# EAGLE schematic DM01 (EAGLE 6.6.0)

## Sheet 1 of 6
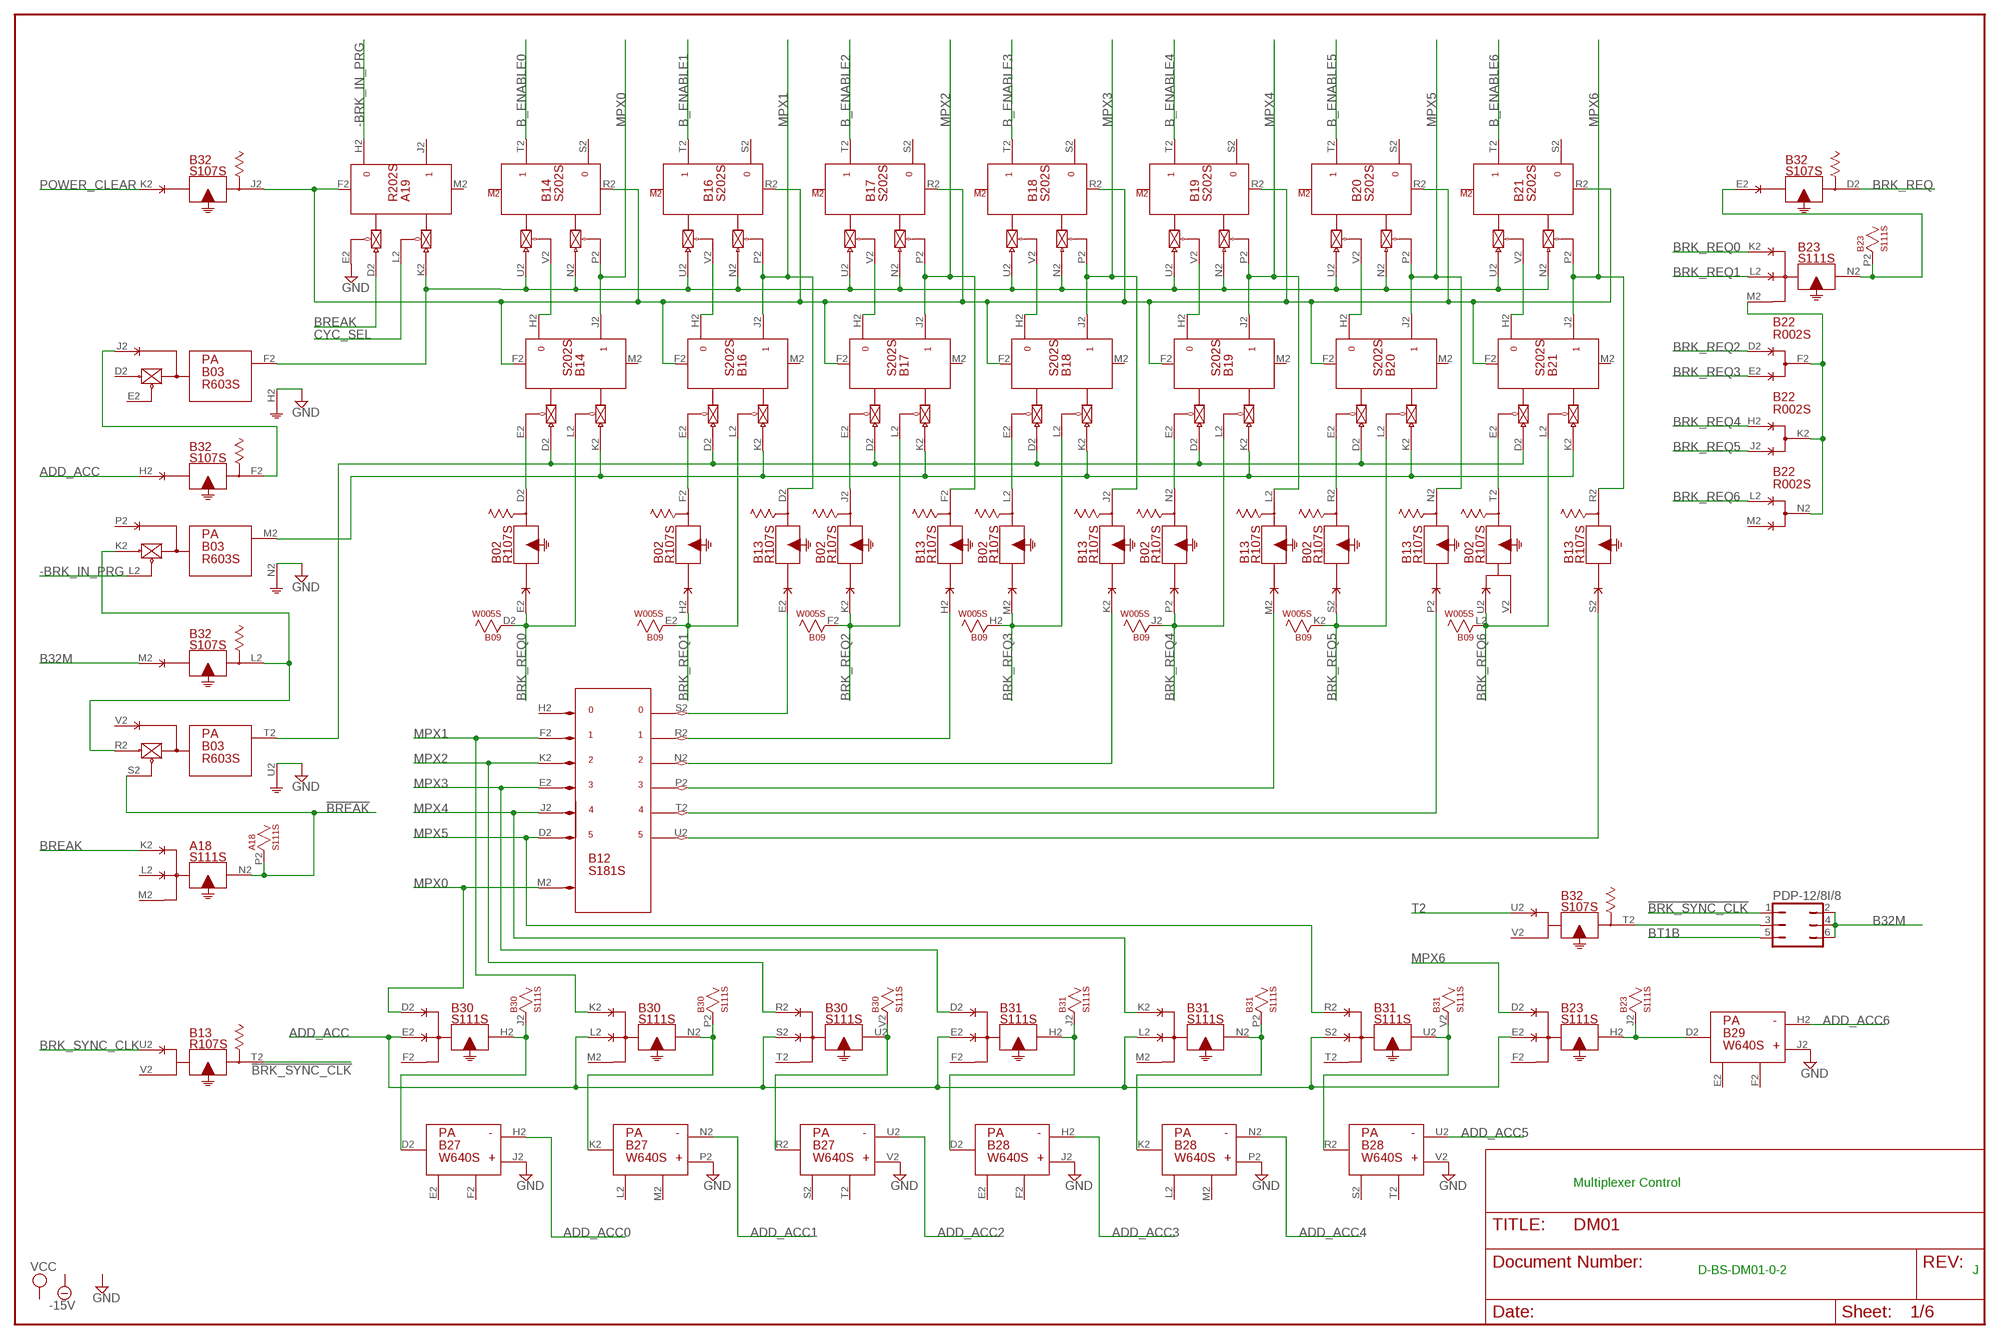
[diagram p0: schematic, sheet 1]

### Parts
A18  S111S  R111S  [H807S]
A19  R202S  [H807S]
B02  R107S  [H807S]
B03  R603S  [H807S]
B09  W005S  [H807S]
B12  S181S  R181S  [H807S]
B13  R107S  [H807S]
B14  S202S  R202S  [H807S]
B16  S202S  R202S  [H807S]
B17  S202S  R202S  [H807S]
B18  S202S  R202S  [H807S]
B19  S202S  R202S  [H807S]
B20  S202S  R202S  [H807S]
B21  S202S  R202S  [H807S]
B22  R002S  [H807S]
B23  S111S  R111S  [H807S]
B27  W640S  [H807S]
B28  W640S  [H807S]
B29  W640S  [H807S]
B30  S111S  R111S  [H807S]
B31  S111S  R111S  [H807S]
B32  S107S  R107S  [H807S]
PDP-12/8I/8  JP3Q  [JP3Q]

### Nets
!BREAK: A18.N2(N:O$1) A18.P2 B03.S2(T:EN0)
!BRK_SYNC_CLK: B13.T2(T:O$1) PDP-12/8I/8.1
-BRK_IN_PRG: A19.H2 B03.L2(M:EN0)
ADD_ACC: B23.E2(H:I$2) B30.E2(H:I$2) B30.L2(N:I$2) B30.S2(U:I$2) B31.E2(H:I$2) B31.L2(N:I$2) B31.S2(U:I$2) B32.H2(F:I$1) ; also sheet 2
ADD_ACC0: B27.H2(H) ; also sheet 2
ADD_ACC1: B27.N2(H) ; also sheet 2
ADD_ACC2: B27.U2(H) ; also sheet 2
ADD_ACC3: B28.H2(H) ; also sheet 2
ADD_ACC4: B28.N2(H) ; also sheet 2
ADD_ACC5: B28.U2(H) ; also sheet 2
ADD_ACC6: B29.H2(H) ; also sheet 2
B32M: B32.M2(L:I$1) PDP-12/8I/8.2 PDP-12/8I/8.4 PDP-12/8I/8.6
B_ENABLE0: B14.T2 ; also sheet 2,4
B_ENABLE1: B16.T2 ; also sheet 2,4
B_ENABLE2: B17.T2 ; also sheet 2,4
B_ENABLE3: B18.T2 ; also sheet 2,4
B_ENABLE4: B19.T2 ; also sheet 2,4
B_ENABLE5: B20.T2 ; also sheet 2,4
B_ENABLE6: B21.T2 ; also sheet 2,4
BREAK: A18.K2(N:I$1) A19.D2(J:PU0) ; also sheet 2,4
BRK_REQ: B32.D2(D:O$1) ; also sheet 2
BRK_REQ0: B02.E2(D:I$1) B09.D2 B14.L2(J:EN1) B23.K2(N:I$1) ; also sheet 2
BRK_REQ1: B02.H2(F:I$1) B09.E2 B16.L2(J:EN1) B23.L2(N:I$2) ; also sheet 2
BRK_REQ2: B02.K2(J:I$1) B09.F2 B17.L2(J:EN1) B22.D2(F:D) ; also sheet 2
BRK_REQ3: B02.M2(L:I$1) B09.H2 B18.L2(J:EN1) B22.E2(F:E) ; also sheet 2
BRK_REQ4: B02.P2(N:I$1) B09.J2 B19.L2(J:EN1) B22.H2(K:D) ; also sheet 2
BRK_REQ5: B02.S2(R:I$1) B09.K2 B20.L2(J:EN1) B22.J2(K:E) ; also sheet 2
BRK_REQ6: B02.U2(T:I$1) B09.L2 B21.L2(J:EN1) B22.L2(N:D) ; also sheet 2
BRK_SYNC_CLK: B13.U2(T:I$1) ; also sheet 3
BT1B: PDP-12/8I/8.5 ; also sheet 3
CYC_SEL: A19.L2(J:EN1) ; also sheet 2,5
GND [Supply]: A19.E2(J:EN0) B03.H2(F:G) B03.N2(M:G) B03.U2(T:G) B27.J2(J) B27.P2(J) B27.V2(J) B28.J2(J) B28.P2(J) B28.V2(J) B29.J2(J) ; also sheet 4
MPX0: B12.M2(M) B14.J2 B14.P2(T:EN0) B30.D2(H:I$1) ; also sheet 2,4
MPX1: B12.F2(F) B13.D2(D:O$1) B16.J2 B16.P2(T:EN0) B30.K2(N:I$1) ; also sheet 2,4
MPX2: B12.K2(K) B13.F2(F:O$1) B17.J2 B17.P2(T:EN0) B30.R2(U:I$1) ; also sheet 2,4
MPX3: B12.E2(E) B13.J2(J:O$1) B18.J2 B18.P2(T:EN0) B31.D2(H:I$1) ; also sheet 2,4
MPX4: B12.J2(J) B13.L2(L:O$1) B19.J2 B19.P2(T:EN0) B31.K2(N:I$1) ; also sheet 2,4
MPX5: B12.D2(D) B13.N2(N:O$1) B20.J2 B20.P2(T:EN0) B31.R2(U:I$1) ; also sheet 2,4
MPX6: B13.R2(R:O$1) B21.J2 B21.P2(T:EN0) B23.D2(H:I$1) ; also sheet 2,4
N$1: A19.K2(J:PU1) B03.F2(F:O) B14.N2(T:PU0) B14.U2(T:PU1) B16.N2(T:PU0) B16.U2(T:PU1) B17.N2(T:PU0) B17.U2(T:PU1) B18.N2(T:PU0) B18.U2(T:PU1) B19.N2(T:PU0) B19.U2(T:PU1) B20.N2(T:PU0) B20.U2(T:PU1) B21.N2(T:PU0) B21.U2(T:PU1)
N$2: A19.F2(J:RESET) B14.F2(J:RESET) B14.R2(T:RESET) B16.F2(J:RESET) B16.R2(T:RESET) B17.F2(J:RESET) B17.R2(T:RESET) B18.F2(J:RESET) B18.R2(T:RESET) B19.F2(J:RESET) B19.R2(T:RESET) B20.F2(J:RESET) B20.R2(T:RESET) B21.F2(J:RESET) B21.R2(T:RESET) B32.J2(J:O$1)
N$3: B03.J2(F:I$1) B32.F2(F:O$1)
N$4: B32.T2(T:O$1) PDP-12/8I/8.3
N$5: B03.K2(M:PU0) B03.R2(T:PU0) B32.L2(L:O$1)
N$6: B03.M2(M:O) B14.K2(J:PU1) B16.K2(J:PU1) B17.K2(J:PU1) B18.K2(J:PU1) B19.K2(J:PU1) B20.K2(J:PU1) B21.K2(J:PU1)
N$7: B14.H2 B14.V2(T:EN1)
N$9: B16.H2 B16.V2(T:EN1)
N$11: B17.H2 B17.V2(T:EN1)
N$13: B18.H2 B18.V2(T:EN1)
N$15: B19.H2 B19.V2(T:EN1)
N$17: B20.H2 B20.V2(T:EN1)
N$19: B21.H2 B21.V2(T:EN1)
N$21: B23.N2(N:O$1) B23.P2 B32.E2(D:I$1)
N$22: B22.F2(F:F) B22.K2(K:F) B22.N2(N:F) B23.M2(N:I$3)
N$23: B02.D2(D:O$1) B14.E2(J:EN0)
N$24: B02.F2(F:O$1) B16.E2(J:EN0)
N$25: B02.J2(J:O$1) B17.E2(J:EN0)
N$26: B02.L2(L:O$1) B18.E2(J:EN0)
N$27: B02.N2(N:O$1) B19.E2(J:EN0)
N$28: B02.R2(R:O$1) B20.E2(J:EN0)
N$29: B02.T2(T:O$1) B21.E2(J:EN0)
N$30: B27.D2(D) B30.H2(H:O$1) B30.J2
N$32: B03.T2(T:O) B14.D2(J:PU0) B16.D2(J:PU0) B17.D2(J:PU0) B18.D2(J:PU0) B19.D2(J:PU0) B20.D2(J:PU0) B21.D2(J:PU0)
N$36: B27.K2(D) B30.N2(N:O$1) B30.P2
N$37: B27.R2(D) B30.U2(U:O$1) B30.V2
N$38: B12.S2(S) B13.E2(D:I$1)
N$39: B12.R2(R) B13.H2(F:I$1)
N$40: B12.N2(N) B13.K2(J:I$1)
N$41: B12.P2(P) B13.M2(L:I$1)
N$42: B12.T2(T) B13.P2(N:I$1)
N$43: B12.U2(U) B13.S2(R:I$1)
N$45: B28.D2(D) B31.H2(H:O$1) B31.J2
N$46: B28.K2(D) B31.N2(N:O$1) B31.P2
N$47: B28.R2(D) B31.U2(U:O$1) B31.V2
N$48: B23.H2(H:O$1) B23.J2 B29.D2(D)
POWER_CLEAR: B32.K2(J:I$1) ; also sheet 3
T2: B32.U2(T:I$1) ; also sheet 3
Unconnected: A18.L2(N:I$2) A18.M2(N:I$3) A18.R2(U:I$1) A18.S2(U:I$2) A18.T2(U:I$3) A18.U2(U:O$1) A18.V2 A19.J2 A19.M2(J:SET) A19.N2(T:PU0) A19.P2(T:EN0) A19.R2(T:RESET) A19.S2 A19.T2 A19.U2(T:PU1) A19.V2(T:EN1) B02.V2(T:I$2) B03.D2(F:PU0) B03.E2(F:EN0) B03.P2(M:I$1) B03.V2(T:I$1) B09.U2 B12.H2(H) B12.L2(I$1) B12.V2(O$1) B13.V2(T:I$2) B14.M2(J:SET) B14.S2 B16.M2(J:SET) B16.S2 B17.M2(J:SET) B17.S2 B18.M2(J:SET) B18.S2 B19.M2(J:SET) B19.S2 B20.M2(J:SET) B20.S2 B21.M2(J:SET) B21.S2 B22.M2(N:E) B22.P2(S:D) B22.R2(S:E) B22.S2(S:F) B22.T2(V:D) B22.U2(V:E) B22.V2(V:F) B23.F2(H:I$3) B27.E2(E) B27.F2(F) B27.L2(E) B27.M2(F) B27.S2(E) B27.T2(F) B28.E2(E) B28.F2(F) B28.L2(E) B28.M2(F) B28.S2(E) B28.T2(F) B29.E2(E) B29.F2(F) B30.F2(H:I$3) B30.M2(N:I$3) B30.T2(U:I$3) B31.F2(H:I$3) B31.M2(N:I$3) B31.T2(U:I$3) B32.V2(T:I$2)

### Notes on the sheet
- Multiplexer Control
- D-BS-DM01-0-2 | J

## Sheet 2 of 6
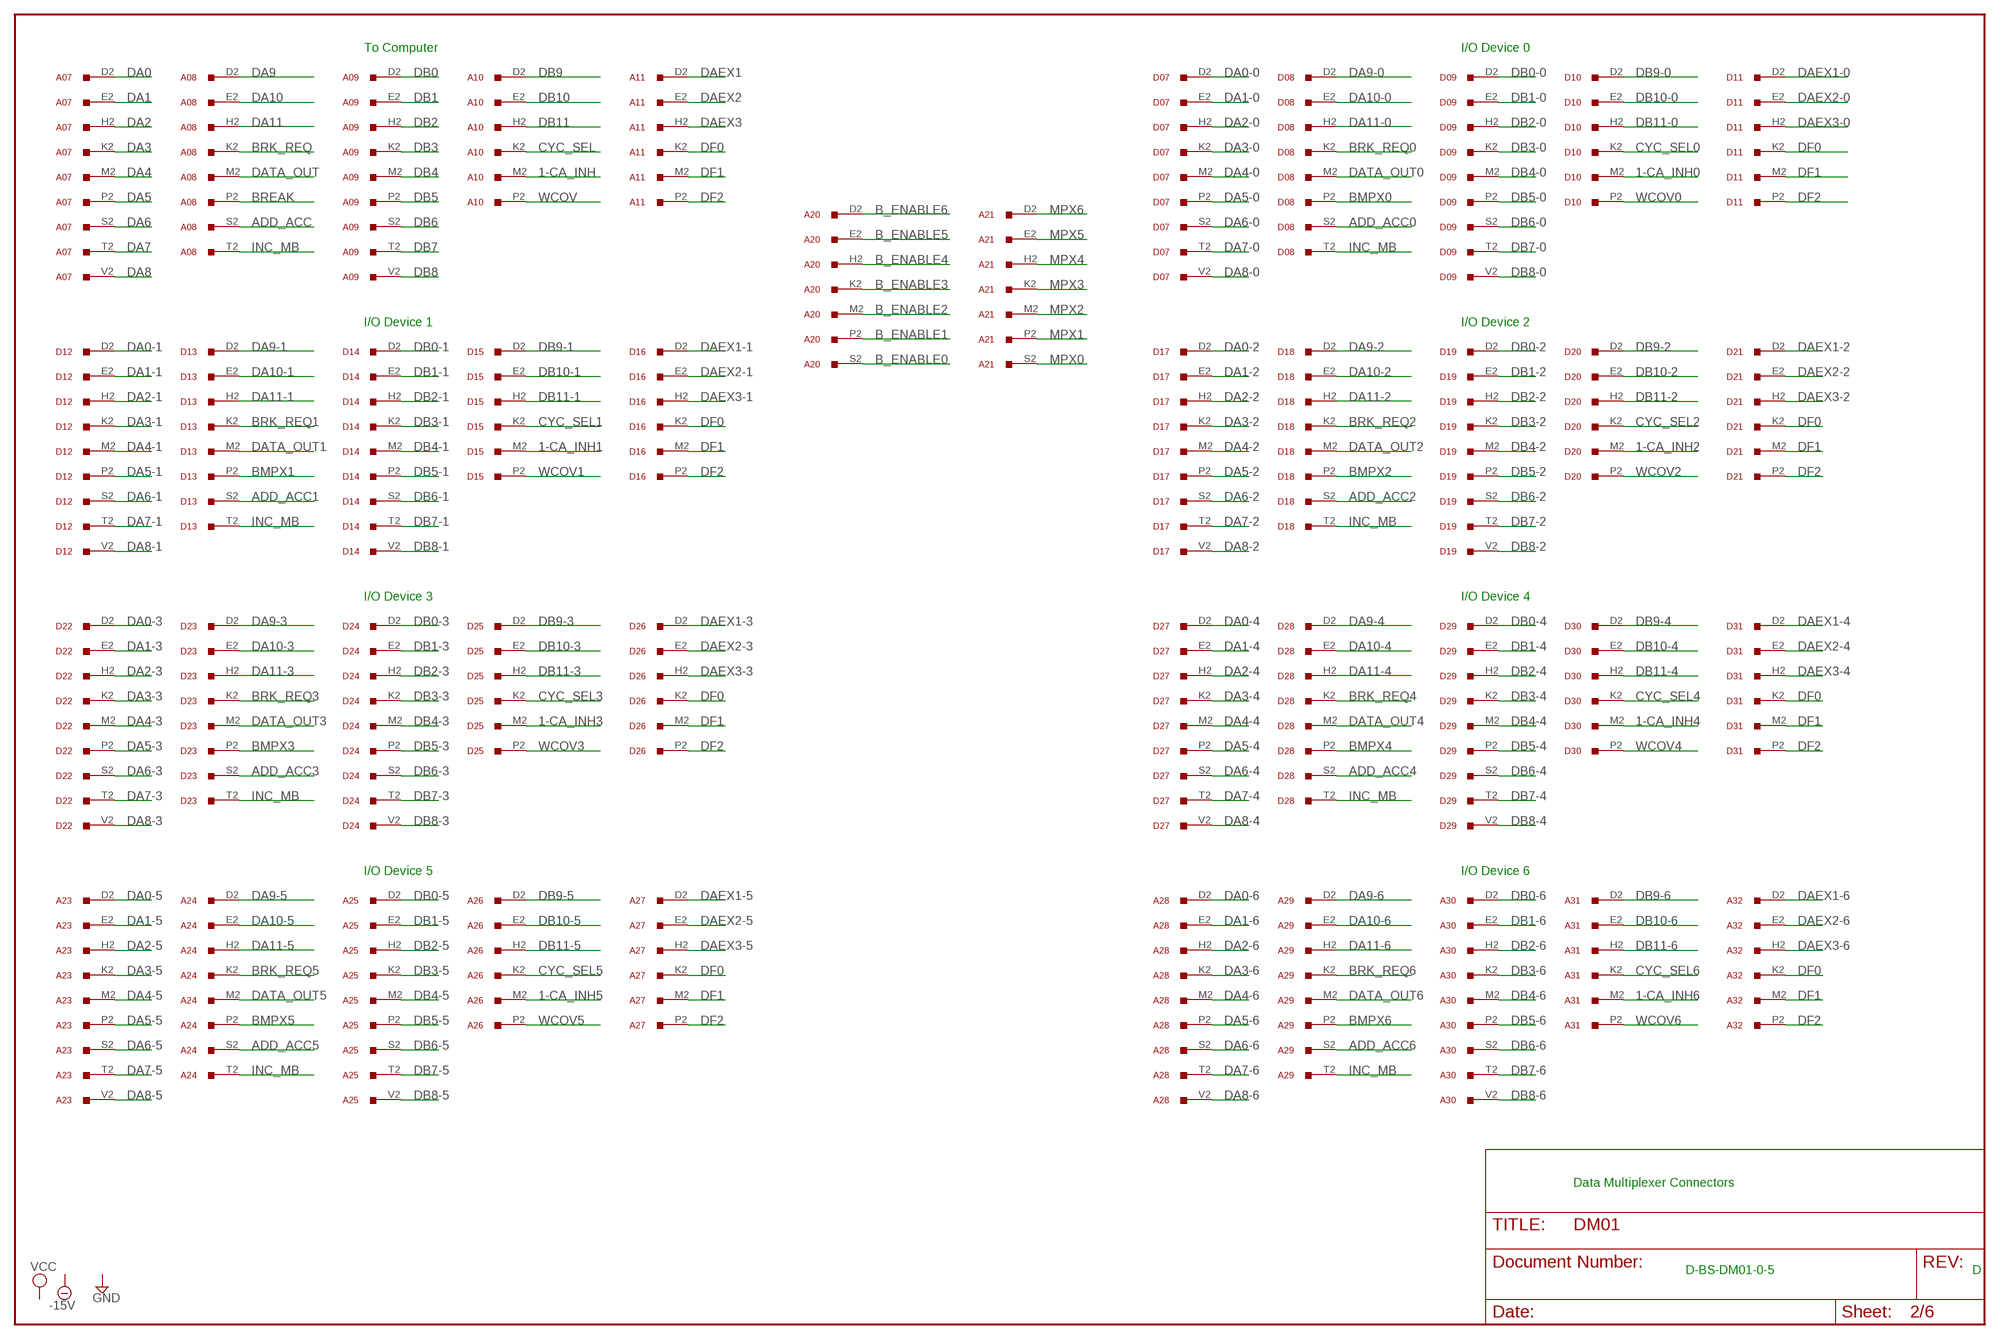
[diagram p1: schematic, sheet 2]

### Parts
A07  W021S  [H807S]
A08  W021S  [H807S]
A09  W021S  [H807S]
A10  W021S  [H807S]
A11  W021S  [H807S]
A20  W021S  [H807S]
A21  W021S  [H807S]
A23  W021S  [H807S]
A24  W021S  [H807S]
A25  W021S  [H807S]
A26  W021S  [H807S]
A27  W021S  [H807S]
A28  W021S  [H807S]
A29  W021S  [H807S]
A30  W021S  [H807S]
A31  W021S  [H807S]
A32  W021S  [H807S]
D07  W021S  [H807S]
D08  W021S  [H807S]
D09  W021S  [H807S]
D10  W021S  [H807S]
D11  W021S  [H807S]
D12  W021S  [H807S]
D13  W021S  [H807S]
D14  W021S  [H807S]
D15  W021S  [H807S]
D16  W021S  [H807S]
D17  W021S  [H807S]
D18  W021S  [H807S]
D19  W021S  [H807S]
D20  W021S  [H807S]
D21  W021S  [H807S]
D22  W021S  [H807S]
D23  W021S  [H807S]
D24  W021S  [H807S]
D25  W021S  [H807S]
D26  W021S  [H807S]
D27  W021S  [H807S]
D28  W021S  [H807S]
D29  W021S  [H807S]
D30  W021S  [H807S]
D31  W021S  [H807S]

### Nets
1-CA_INH: A10.M2 ; also sheet 6
1-CA_INH0: D10.M2 ; also sheet 6
1-CA_INH1: D15.M2 ; also sheet 6
1-CA_INH2: D20.M2 ; also sheet 6
1-CA_INH3: D25.M2 ; also sheet 6
1-CA_INH4: D30.M2 ; also sheet 6
1-CA_INH5: A26.M2 ; also sheet 6
1-CA_INH6: A31.M2 ; also sheet 6
ADD_ACC: A08.S2 ; also sheet 1
ADD_ACC0: D08.S2 ; also sheet 1
ADD_ACC1: D13.S2 ; also sheet 1
ADD_ACC2: D18.S2 ; also sheet 1
ADD_ACC3: D23.S2 ; also sheet 1
ADD_ACC4: D28.S2 ; also sheet 1
ADD_ACC5: A24.S2 ; also sheet 1
ADD_ACC6: A29.S2 ; also sheet 1
B_ENABLE0: A20.S2 ; also sheet 1,4
B_ENABLE1: A20.P2 ; also sheet 1,4
B_ENABLE2: A20.M2 ; also sheet 1,4
B_ENABLE3: A20.K2 ; also sheet 1,4
B_ENABLE4: A20.H2 ; also sheet 1,4
B_ENABLE5: A20.E2 ; also sheet 1,4
B_ENABLE6: A20.D2 ; also sheet 1,4
BMPX0: D08.P2 ; also sheet 4
BMPX1: D13.P2 ; also sheet 4
BMPX2: D18.P2 ; also sheet 4
BMPX3: D23.P2 ; also sheet 4
BMPX4: D28.P2 ; also sheet 4
BMPX5: A24.P2 ; also sheet 4
BMPX6: A29.P2 ; also sheet 4
BREAK: A08.P2 ; also sheet 1,4
BRK_REQ: A08.K2 ; also sheet 1
BRK_REQ0: D08.K2 ; also sheet 1
BRK_REQ1: D13.K2 ; also sheet 1
BRK_REQ2: D18.K2 ; also sheet 1
BRK_REQ3: D23.K2 ; also sheet 1
BRK_REQ4: D28.K2 ; also sheet 1
BRK_REQ5: A24.K2 ; also sheet 1
BRK_REQ6: A29.K2 ; also sheet 1
CYC_SEL: A10.K2 ; also sheet 1,5
CYC_SEL0: D10.K2 ; also sheet 5
CYC_SEL1: D15.K2 ; also sheet 5
CYC_SEL2: D20.K2 ; also sheet 5
CYC_SEL3: D25.K2 ; also sheet 5
CYC_SEL4: D30.K2 ; also sheet 5
CYC_SEL5: A26.K2 ; also sheet 5
CYC_SEL6: A31.K2 ; also sheet 5
DA0: A07.D2 ; also sheet 5
DA0-0: D07.D2 ; also sheet 5
DA0-1: D12.D2 ; also sheet 5
DA0-2: D17.D2 ; also sheet 5
DA0-3: D22.D2 ; also sheet 5
DA0-4: D27.D2 ; also sheet 5
DA0-5: A23.D2 ; also sheet 5
DA0-6: A28.D2 ; also sheet 5
DA1: A07.E2 ; also sheet 5
DA1-0: D07.E2 ; also sheet 5
DA1-1: D12.E2 ; also sheet 5
DA1-2: D17.E2 ; also sheet 5
DA1-3: D22.E2 ; also sheet 5
DA1-4: D27.E2 ; also sheet 5
DA1-5: A23.E2 ; also sheet 5
DA1-6: A28.E2 ; also sheet 5
DA2: A07.H2 ; also sheet 5
DA2-0: D07.H2 ; also sheet 5
DA2-1: D12.H2 ; also sheet 5
DA2-2: D17.H2 ; also sheet 5
DA2-3: D22.H2 ; also sheet 5
DA2-4: D27.H2 ; also sheet 5
DA2-5: A23.H2 ; also sheet 5
DA2-6: A28.H2 ; also sheet 5
DA3: A07.K2 ; also sheet 5
DA3-0: D07.K2 ; also sheet 5
DA3-1: D12.K2 ; also sheet 5
DA3-2: D17.K2 ; also sheet 5
DA3-3: D22.K2 ; also sheet 5
DA3-4: D27.K2 ; also sheet 5
DA3-5: A23.K2 ; also sheet 5
DA3-6: A28.K2 ; also sheet 5
DA4: A07.M2 ; also sheet 5
DA4-0: D07.M2 ; also sheet 5
DA4-1: D12.M2 ; also sheet 5
DA4-2: D17.M2 ; also sheet 5
DA4-3: D22.M2 ; also sheet 5
DA4-4: D27.M2 ; also sheet 5
DA4-5: A23.M2 ; also sheet 5
DA4-6: A28.M2 ; also sheet 5
DA5: A07.P2 ; also sheet 5
DA5-0: D07.P2 ; also sheet 5
DA5-1: D12.P2 ; also sheet 5
DA5-2: D17.P2 ; also sheet 5
DA5-3: D22.P2 ; also sheet 5
DA5-4: D27.P2 ; also sheet 5
DA5-5: A23.P2 ; also sheet 5
DA5-6: A28.P2 ; also sheet 5
DA6: A07.S2 ; also sheet 5
DA6-0: D07.S2 ; also sheet 5
DA6-1: D12.S2 ; also sheet 5
DA6-2: D17.S2 ; also sheet 5
DA6-3: D22.S2 ; also sheet 5
DA6-4: D27.S2 ; also sheet 5
DA6-5: A23.S2 ; also sheet 5
DA6-6: A28.S2 ; also sheet 5
DA7: A07.T2 ; also sheet 5
DA7-0: D07.T2 ; also sheet 5
DA7-1: D12.T2 ; also sheet 5
DA7-2: D17.T2 ; also sheet 5
DA7-3: D22.T2 ; also sheet 5
DA7-4: D27.T2 ; also sheet 5
DA7-5: A23.T2 ; also sheet 5
DA7-6: A28.T2 ; also sheet 5
DA8: A07.V2 ; also sheet 5
DA8-0: D07.V2 ; also sheet 5
DA8-1: D12.V2 ; also sheet 5
DA8-2: D17.V2 ; also sheet 5
DA8-3: D22.V2 ; also sheet 5
DA8-4: D27.V2 ; also sheet 5
DA8-5: A23.V2 ; also sheet 5
DA8-6: A28.V2 ; also sheet 5
DA9: A08.D2 ; also sheet 5
DA9-0: D08.D2 ; also sheet 5
DA9-1: D13.D2 ; also sheet 5
DA9-2: D18.D2 ; also sheet 5
DA9-3: D23.D2 ; also sheet 5
DA9-4: D28.D2 ; also sheet 5
DA9-5: A24.D2 ; also sheet 5
DA9-6: A29.D2 ; also sheet 5
DA10: A08.E2 ; also sheet 5
DA10-0: D08.E2 ; also sheet 5
DA10-1: D13.E2 ; also sheet 5
DA10-2: D18.E2 ; also sheet 5
DA10-3: D23.E2 ; also sheet 5
DA10-4: D28.E2 ; also sheet 5
DA10-5: A24.E2 ; also sheet 5
DA10-6: A29.E2 ; also sheet 5
DA11: A08.H2 ; also sheet 5
DA11-0: D08.H2 ; also sheet 5
DA11-1: D13.H2 ; also sheet 5
DA11-2: D18.H2 ; also sheet 5
DA11-3: D23.H2 ; also sheet 5
DA11-4: D28.H2 ; also sheet 5
DA11-5: A24.H2 ; also sheet 5
DA11-6: A29.H2 ; also sheet 5
DAEX1: A11.D2 ; also sheet 5
DAEX1-0: D11.D2 ; also sheet 5
DAEX1-1: D16.D2 ; also sheet 5
DAEX1-2: D21.D2 ; also sheet 5
DAEX1-3: D26.D2 ; also sheet 5
DAEX1-4: D31.D2 ; also sheet 5
DAEX1-5: A27.D2 ; also sheet 5
DAEX1-6: A32.D2 ; also sheet 5
DAEX2: A11.E2 ; also sheet 5
DAEX2-0: D11.E2 ; also sheet 5
DAEX2-1: D16.E2 ; also sheet 5
DAEX2-2: D21.E2 ; also sheet 5
DAEX2-3: D26.E2 ; also sheet 5
DAEX2-4: D31.E2 ; also sheet 5
DAEX2-5: A27.E2 ; also sheet 5
DAEX2-6: A32.E2 ; also sheet 5
DAEX3: A11.H2 ; also sheet 5
DAEX3-0: D11.H2 ; also sheet 5
DAEX3-1: D16.H2 ; also sheet 5
DAEX3-2: D21.H2 ; also sheet 5
DAEX3-3: D26.H2 ; also sheet 5
DAEX3-4: D31.H2 ; also sheet 5
DAEX3-5: A27.H2 ; also sheet 5
DAEX3-6: A32.H2 ; also sheet 5
DATA_OUT: A08.M2 ; also sheet 6
DATA_OUT0: D08.M2 ; also sheet 6
DATA_OUT1: D13.M2 ; also sheet 6
DATA_OUT2: D18.M2 ; also sheet 6
DATA_OUT3: D23.M2 ; also sheet 6
DATA_OUT4: D28.M2 ; also sheet 6
DATA_OUT5: A24.M2 ; also sheet 6
DATA_OUT6: A29.M2 ; also sheet 6
DB0: A09.D2 ; also sheet 6
DB0-0: D09.D2 ; also sheet 6
DB0-1: D14.D2 ; also sheet 6
DB0-2: D19.D2 ; also sheet 6
DB0-3: D24.D2 ; also sheet 6
DB0-4: D29.D2 ; also sheet 6
DB0-5: A25.D2 ; also sheet 6
DB0-6: A30.D2 ; also sheet 6
DB1: A09.E2 ; also sheet 6
DB1-0: D09.E2 ; also sheet 6
DB1-1: D14.E2 ; also sheet 6
DB1-2: D19.E2 ; also sheet 6
DB1-3: D24.E2 ; also sheet 6
DB1-4: D29.E2 ; also sheet 6
DB1-5: A25.E2 ; also sheet 6
DB1-6: A30.E2 ; also sheet 6
DB2: A09.H2 ; also sheet 6
DB2-0: D09.H2 ; also sheet 6
DB2-1: D14.H2 ; also sheet 6
DB2-2: D19.H2 ; also sheet 6
DB2-3: D24.H2 ; also sheet 6
DB2-4: D29.H2 ; also sheet 6
DB2-5: A25.H2 ; also sheet 6
DB2-6: A30.H2 ; also sheet 6
DB3: A09.K2 ; also sheet 6
DB3-0: D09.K2 ; also sheet 6
DB3-1: D14.K2 ; also sheet 6
DB3-2: D19.K2 ; also sheet 6
DB3-3: D24.K2 ; also sheet 6
DB3-4: D29.K2 ; also sheet 6
DB3-5: A25.K2 ; also sheet 6
DB3-6: A30.K2 ; also sheet 6
DB4: A09.M2 ; also sheet 6
DB4-0: D09.M2 ; also sheet 6
DB4-1: D14.M2 ; also sheet 6
DB4-2: D19.M2 ; also sheet 6
DB4-3: D24.M2 ; also sheet 6
DB4-4: D29.M2 ; also sheet 6
DB4-5: A25.M2 ; also sheet 6
DB4-6: A30.M2 ; also sheet 6
DB5: A09.P2 ; also sheet 6
DB5-0: D09.P2 ; also sheet 6
DB5-1: D14.P2 ; also sheet 6
DB5-2: D19.P2 ; also sheet 6
DB5-3: D24.P2 ; also sheet 6
DB5-4: D29.P2 ; also sheet 6
DB5-5: A25.P2 ; also sheet 6
DB5-6: A30.P2 ; also sheet 6
DB6: A09.S2 ; also sheet 6
DB6-0: D09.S2 ; also sheet 6
DB6-1: D14.S2 ; also sheet 6
DB6-2: D19.S2 ; also sheet 6
DB6-3: D24.S2 ; also sheet 6
DB6-4: D29.S2 ; also sheet 6
DB6-5: A25.S2 ; also sheet 6
DB6-6: A30.S2 ; also sheet 6
DB7: A09.T2 ; also sheet 6
DB7-0: D09.T2 ; also sheet 6
DB7-1: D14.T2 ; also sheet 6
DB7-2: D19.T2 ; also sheet 6
DB7-3: D24.T2 ; also sheet 6
DB7-4: D29.T2 ; also sheet 6
DB7-5: A25.T2 ; also sheet 6
DB7-6: A30.T2 ; also sheet 6
DB8: A09.V2 ; also sheet 6
DB8-0: D09.V2 ; also sheet 6
DB8-1: D14.V2 ; also sheet 6
DB8-2: D19.V2 ; also sheet 6
DB8-3: D24.V2 ; also sheet 6
DB8-4: D29.V2 ; also sheet 6
DB8-5: A25.V2 ; also sheet 6
DB8-6: A30.V2 ; also sheet 6
DB9: A10.D2 ; also sheet 6
DB9-0: D10.D2 ; also sheet 6
DB9-1: D15.D2 ; also sheet 6
DB9-2: D20.D2 ; also sheet 6
DB9-3: D25.D2 ; also sheet 6
DB9-4: D30.D2 ; also sheet 6
DB9-5: A26.D2 ; also sheet 6
DB9-6: A31.D2 ; also sheet 6
DB10: A10.E2 ; also sheet 6
DB10-0: D10.E2 ; also sheet 6
DB10-1: D15.E2 ; also sheet 6
DB10-2: D20.E2 ; also sheet 6
DB10-3: D25.E2 ; also sheet 6
DB10-4: D30.E2 ; also sheet 6
DB10-5: A26.E2 ; also sheet 6
DB10-6: A31.E2 ; also sheet 6
DB11: A10.H2 ; also sheet 6
DB11-0: D10.H2 ; also sheet 6
DB11-1: D15.H2 ; also sheet 6
DB11-2: D20.H2 ; also sheet 6
DB11-3: D25.H2 ; also sheet 6
DB11-4: D30.H2 ; also sheet 6
DB11-5: A26.H2 ; also sheet 6
DB11-6: A31.H2 ; also sheet 6
DF0: A11.K2 A27.K2 A32.K2 D11.K2 D16.K2 D21.K2 D26.K2 D31.K2
DF1: A11.M2 A27.M2 A32.M2 D11.M2 D16.M2 D21.M2 D26.M2 D31.M2
DF2: A11.P2 A27.P2 A32.P2 D11.P2 D16.P2 D21.P2 D26.P2 D31.P2
INC_MB: A08.T2 A24.T2 A29.T2 D08.T2 D13.T2 D18.T2 D23.T2 D28.T2
MPX0: A21.S2 ; also sheet 1,4
MPX1: A21.P2 ; also sheet 1,4
MPX2: A21.M2 ; also sheet 1,4
MPX3: A21.K2 ; also sheet 1,4
MPX4: A21.H2 ; also sheet 1,4
MPX5: A21.E2 ; also sheet 1,4
MPX6: A21.D2 ; also sheet 1,4
WCOV: A10.P2 ; also sheet 4
WCOV0: D10.P2 ; also sheet 4
WCOV1: D15.P2 ; also sheet 4
WCOV2: D20.P2 ; also sheet 4
WCOV3: D25.P2 ; also sheet 4
WCOV4: D30.P2 ; also sheet 4
WCOV5: A26.P2 ; also sheet 4
WCOV6: A31.P2 ; also sheet 4
Unconnected: A08.V2 A10.S2 A10.T2 A10.V2 A11.S2 A11.T2 A11.V2 A20.T2 A20.V2 A21.T2 A21.V2 A24.V2 A26.S2 A26.T2 A26.V2 A27.S2 A27.T2 A27.V2 A29.V2 A31.S2 A31.T2 A31.V2 A32.S2 A32.T2 A32.V2 D08.V2 D10.S2 D10.T2 D10.V2 D11.S2 D11.T2 D11.V2 D13.V2 D15.S2 D15.T2 D15.V2 D16.S2 D16.T2 D16.V2 D18.V2 D20.S2 D20.T2 D20.V2 D21.S2 D21.T2 D21.V2 D23.V2 D25.S2 D25.T2 D25.V2 D26.S2 D26.T2 D26.V2 D28.V2 D30.S2 D30.T2 D30.V2 D31.S2 D31.T2 D31.V2

### Notes on the sheet
- To Computer | I/O Device 0
- I/O Device 1 | I/O Device 2
- I/O Device 3 | I/O Device 4
- I/O Device 5 | I/O Device 6
- Data Multiplexer Connectors
- D-BS-DM01-0-5 | D

## Sheet 3 of 6
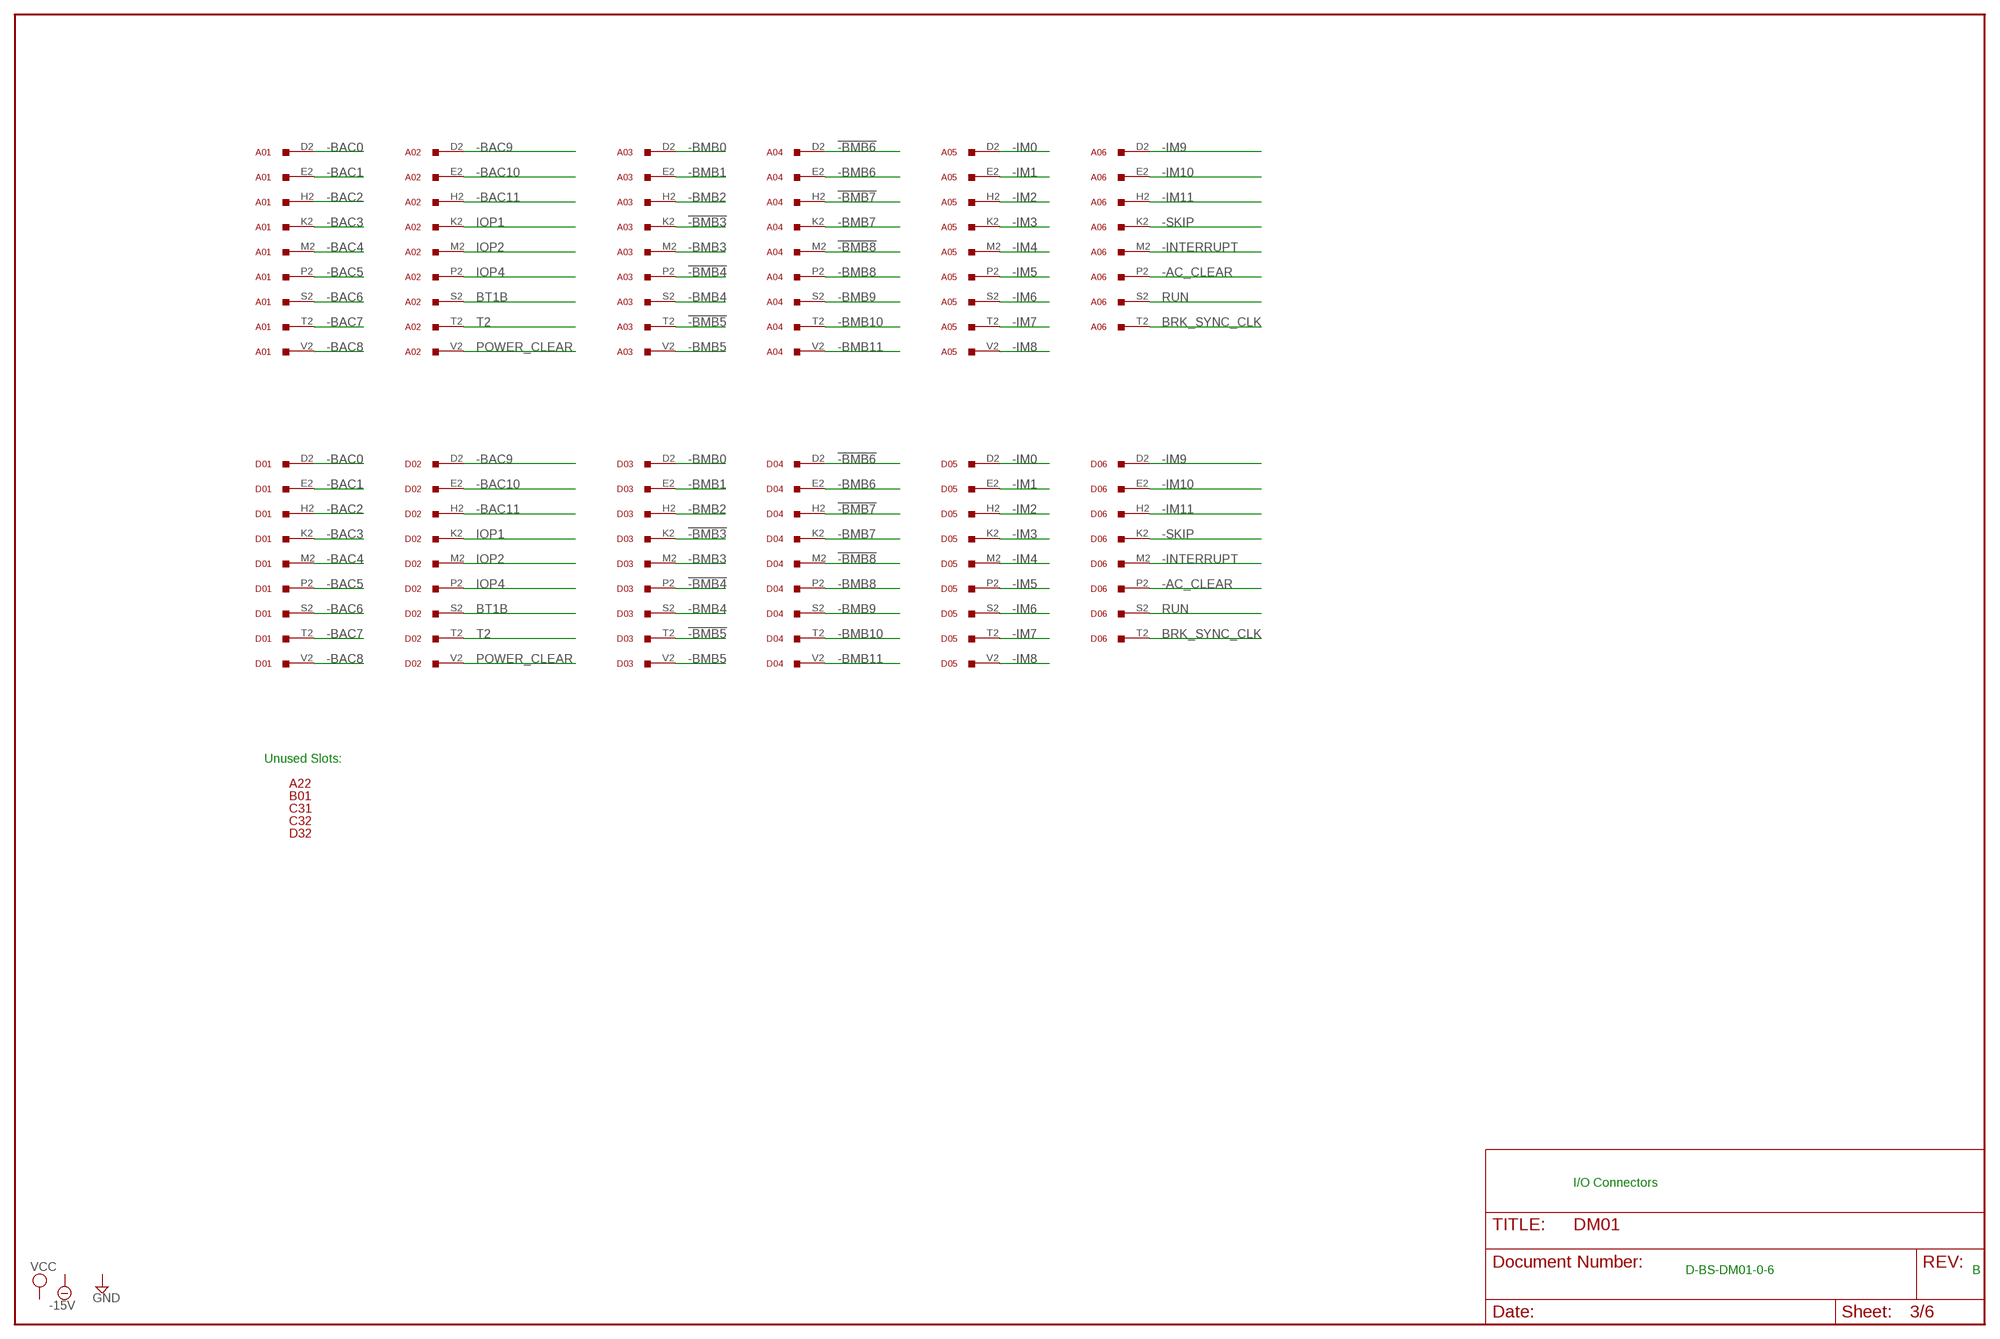
[diagram p2: schematic, sheet 3]

### Parts
A01  W021S  [H807S]
A02  W021S  [H807S]
A03  W021S  [H807S]
A04  W021S  [H807S]
A05  W021S  [H807S]
A06  W021S  [H807S]
A22  EMPTYS  [H807S]
B01  EMPTYS  [H807S]
C31  EMPTYS  [H807S]
C32  EMPTYS  [H807S]
D01  W021S  [H807S]
D02  W021S  [H807S]
D03  W021S  [H807S]
D04  W021S  [H807S]
D05  W021S  [H807S]
D06  W021S  [H807S]
D32  EMPTYS  [H807S]

### Nets
!-BMB3: A03.K2 D03.K2
!-BMB4: A03.P2 D03.P2
!-BMB5: A03.T2 D03.T2
!-BMB6: A04.D2 D04.D2
!-BMB7: A04.H2 D04.H2
!-BMB8: A04.M2 D04.M2
-AC_CLEAR: A06.P2 D06.P2
-BAC0: A01.D2 D01.D2
-BAC1: A01.E2 D01.E2
-BAC2: A01.H2 D01.H2
-BAC3: A01.K2 D01.K2
-BAC4: A01.M2 D01.M2
-BAC5: A01.P2 D01.P2
-BAC6: A01.S2 D01.S2
-BAC7: A01.T2 D01.T2
-BAC8: A01.V2 D01.V2
-BAC9: A02.D2 D02.D2
-BAC10: A02.E2 D02.E2
-BAC11: A02.H2 D02.H2
-BMB0: A03.D2 D03.D2
-BMB1: A03.E2 D03.E2
-BMB2: A03.H2 D03.H2
-BMB3: A03.M2 D03.M2
-BMB4: A03.S2 D03.S2
-BMB5: A03.V2 D03.V2
-BMB6: A04.E2 D04.E2
-BMB7: A04.K2 D04.K2
-BMB8: A04.P2 D04.P2
-BMB9: A04.S2 D04.S2
-BMB10: A04.T2 D04.T2
-BMB11: A04.V2 D04.V2
-IM0: A05.D2 D05.D2
-IM1: A05.E2 D05.E2
-IM2: A05.H2 D05.H2
-IM3: A05.K2 D05.K2
-IM4: A05.M2 D05.M2
-IM5: A05.P2 D05.P2
-IM6: A05.S2 D05.S2
-IM7: A05.T2 D05.T2
-IM8: A05.V2 D05.V2
-IM9: A06.D2 D06.D2
-IM10: A06.E2 D06.E2
-IM11: A06.H2 D06.H2
-INTERRUPT: A06.M2 D06.M2
-SKIP: A06.K2 D06.K2
BRK_SYNC_CLK: A06.T2 D06.T2 ; also sheet 1
BT1B: A02.S2 D02.S2 ; also sheet 1
IOP1: A02.K2 D02.K2
IOP2: A02.M2 D02.M2
IOP4: A02.P2 D02.P2
POWER_CLEAR: A02.V2 D02.V2 ; also sheet 1
RUN: A06.S2 D06.S2
T2: A02.T2 D02.T2 ; also sheet 1
Unconnected: A06.V2 D06.V2

### Notes on the sheet
- Unused Slots:
- I/O Connectors
- D-BS-DM01-0-6 | B

## Sheet 4 of 6
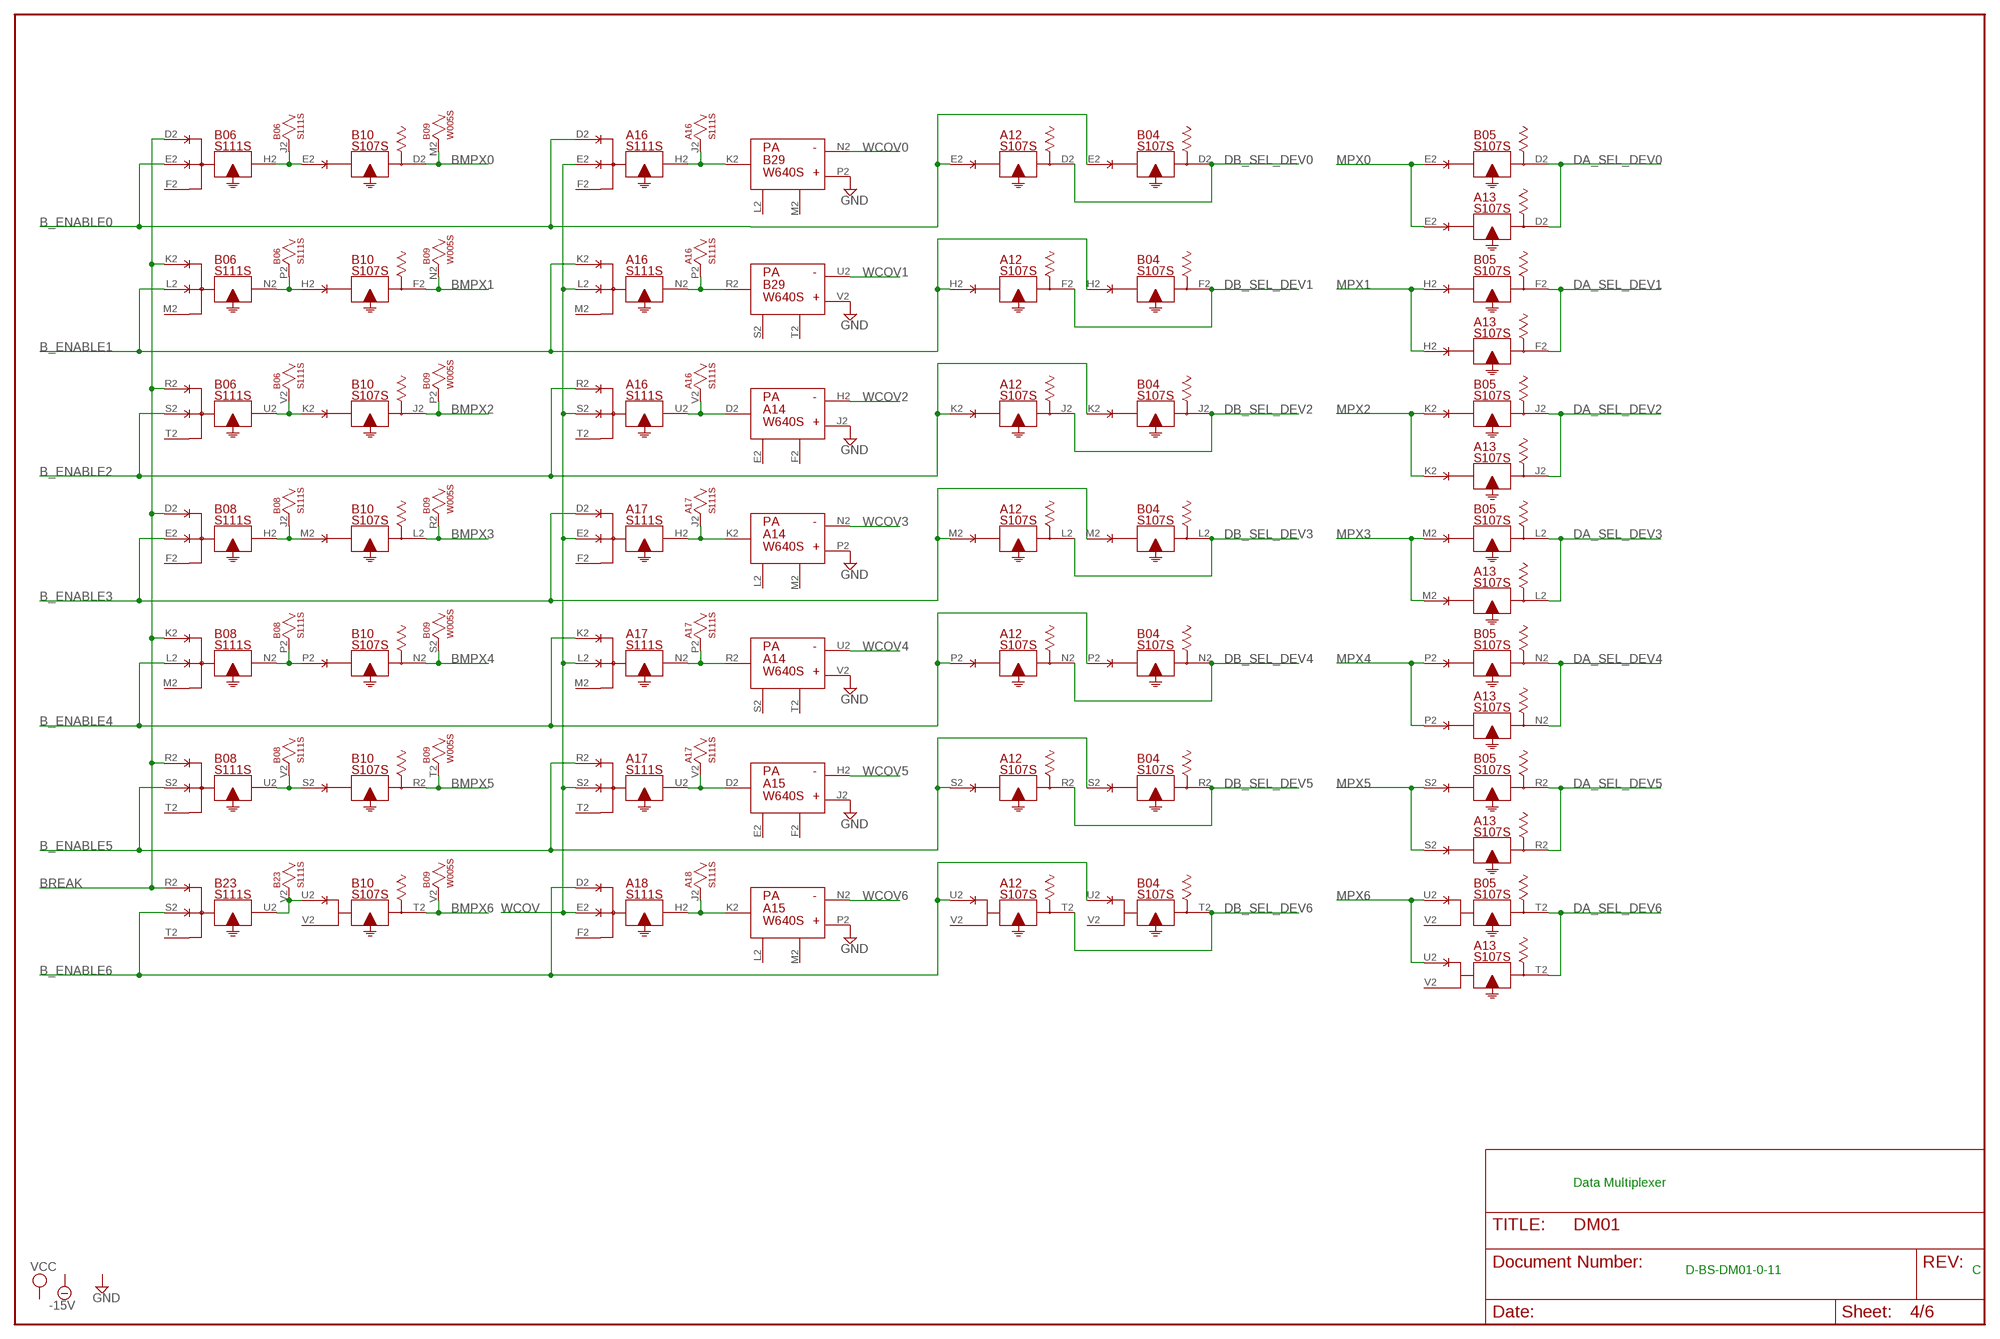
[diagram p3: schematic, sheet 4]

### Parts
A12  S107S  R107S  [H807S]
A13  S107S  R107S  [H807S]
A14  W640S  [H807S]
A15  W640S  [H807S]
A16  S111S  R111S  [H807S]
A17  S111S  R111S  [H807S]
B04  S107S  R107S  [H807S]
B05  S107S  R107S  [H807S]
B06  S111S  R111S  [H807S]
B08  S111S  R111S  [H807S]
B10  S107S  R107S  [H807S]

### Nets
B_ENABLE0: A12.E2(D:I$1) A16.D2(H:I$1) B04.E2(D:I$1) B06.E2(H:I$2) ; also sheet 1,2
B_ENABLE1: A12.H2(F:I$1) A16.K2(N:I$1) B04.H2(F:I$1) B06.L2(N:I$2) ; also sheet 1,2
B_ENABLE2: A12.K2(J:I$1) A16.R2(U:I$1) B04.K2(J:I$1) B06.S2(U:I$2) ; also sheet 1,2
B_ENABLE3: A12.M2(L:I$1) A17.D2(H:I$1) B04.M2(L:I$1) B08.E2(H:I$2) ; also sheet 1,2
B_ENABLE4: A12.P2(N:I$1) A17.K2(N:I$1) B04.P2(N:I$1) B08.L2(N:I$2) ; also sheet 1,2
B_ENABLE5: A12.S2(R:I$1) A17.R2(U:I$1) B04.S2(R:I$1) B08.S2(U:I$2) ; also sheet 1,2
B_ENABLE6: A12.U2(T:I$1) A18.D2(H:I$1) B04.U2(T:I$1) B23.S2(U:I$2) ; also sheet 1,2
BMPX0: B09.M2 B10.D2(D:O$1) ; also sheet 2
BMPX1: B09.N2 B10.F2(F:O$1) ; also sheet 2
BMPX2: B09.P2 B10.J2(J:O$1) ; also sheet 2
BMPX3: B09.R2 B10.L2(L:O$1) ; also sheet 2
BMPX4: B09.S2 B10.N2(N:O$1) ; also sheet 2
BMPX5: B09.T2 B10.R2(R:O$1) ; also sheet 2
BMPX6: B09.V2 B10.T2(T:O$1) ; also sheet 2
BREAK: B06.D2(H:I$1) B06.K2(N:I$1) B06.R2(U:I$1) B08.D2(H:I$1) B08.K2(N:I$1) B08.R2(U:I$1) B23.R2(U:I$1) ; also sheet 1,2
DA_SEL_DEV0: A13.D2(D:O$1) B05.D2(D:O$1) ; also sheet 5
DA_SEL_DEV1: A13.F2(F:O$1) B05.F2(F:O$1) ; also sheet 5
DA_SEL_DEV2: A13.J2(J:O$1) B05.J2(J:O$1) ; also sheet 5
DA_SEL_DEV3: A13.L2(L:O$1) B05.L2(L:O$1) ; also sheet 5
DA_SEL_DEV4: A13.N2(N:O$1) B05.N2(N:O$1) ; also sheet 5
DA_SEL_DEV5: A13.R2(R:O$1) B05.R2(R:O$1) ; also sheet 5
DA_SEL_DEV6: A13.T2(T:O$1) B05.T2(T:O$1) ; also sheet 5
DB_SEL_DEV0: A12.D2(D:O$1) B04.D2(D:O$1) ; also sheet 6
DB_SEL_DEV1: A12.F2(F:O$1) B04.F2(F:O$1) ; also sheet 6
DB_SEL_DEV2: A12.J2(J:O$1) B04.J2(J:O$1) ; also sheet 6
DB_SEL_DEV3: A12.L2(L:O$1) B04.L2(L:O$1) ; also sheet 6
DB_SEL_DEV4: A12.N2(N:O$1) B04.N2(N:O$1) ; also sheet 6
DB_SEL_DEV5: A12.R2(R:O$1) B04.R2(R:O$1) ; also sheet 6
DB_SEL_DEV6: A12.T2(T:O$1) B04.T2(T:O$1) ; also sheet 6
GND [Supply]: A14.J2(J) A14.P2(J) A14.V2(J) A15.J2(J) A15.P2(J) B29.P2(J) B29.V2(J) ; also sheet 1
MPX0: A13.E2(D:I$1) B05.E2(D:I$1) ; also sheet 1,2
MPX1: A13.H2(F:I$1) B05.H2(F:I$1) ; also sheet 1,2
MPX2: A13.K2(J:I$1) B05.K2(J:I$1) ; also sheet 1,2
MPX3: A13.M2(L:I$1) B05.M2(L:I$1) ; also sheet 1,2
MPX4: A13.P2(N:I$1) B05.P2(N:I$1) ; also sheet 1,2
MPX5: A13.S2(R:I$1) B05.S2(R:I$1) ; also sheet 1,2
MPX6: A13.U2(T:I$1) B05.U2(T:I$1) ; also sheet 1,2
N$49: A16.H2(H:O$1) A16.J2 B29.K2(D)
N$50: A16.N2(N:O$1) A16.P2 B29.R2(D)
N$51: A14.D2(D) A16.U2(U:O$1) A16.V2
N$52: A14.K2(D) A17.H2(H:O$1) A17.J2
N$53: A14.R2(D) A17.N2(N:O$1) A17.P2
N$54: A15.D2(D) A17.U2(U:O$1) A17.V2
N$55: A15.K2(D) A18.H2(H:O$1) A18.J2
N$64: B06.H2(H:O$1) B06.J2 B10.E2(D:I$1)
N$65: B06.N2(N:O$1) B06.P2 B10.H2(F:I$1)
N$66: B10.U2(T:I$1) B23.U2(U:O$1) B23.V2
N$67: B08.U2(U:O$1) B08.V2 B10.S2(R:I$1)
N$68: B08.N2(N:O$1) B08.P2 B10.P2(N:I$1)
N$69: B08.H2(H:O$1) B08.J2 B10.M2(L:I$1)
N$70: B06.U2(U:O$1) B06.V2 B10.K2(J:I$1)
WCOV: A16.E2(H:I$2) A16.L2(N:I$2) A16.S2(U:I$2) A17.E2(H:I$2) A17.L2(N:I$2) A17.S2(U:I$2) A18.E2(H:I$2) ; also sheet 2
WCOV0: B29.N2(H) ; also sheet 2
WCOV1: B29.U2(H) ; also sheet 2
WCOV2: A14.H2(H) ; also sheet 2
WCOV3: A14.N2(H) ; also sheet 2
WCOV4: A14.U2(H) ; also sheet 2
WCOV5: A15.H2(H) ; also sheet 2
WCOV6: A15.N2(H) ; also sheet 2
Unconnected: A12.V2(T:I$2) A13.V2(T:I$2) A14.E2(E) A14.F2(F) A14.L2(E) A14.M2(F) A14.S2(E) A14.T2(F) A15.E2(E) A15.F2(F) A15.L2(E) A15.M2(F) A15.R2(D) A15.S2(E) A15.T2(F) A15.U2(H) A15.V2(J) A16.F2(H:I$3) A16.M2(N:I$3) A16.T2(U:I$3) A17.F2(H:I$3) A17.M2(N:I$3) A17.T2(U:I$3) A18.F2(H:I$3) B04.V2(T:I$2) B05.V2(T:I$2) B06.F2(H:I$3) B06.M2(N:I$3) B06.T2(U:I$3) B08.F2(H:I$3) B08.M2(N:I$3) B08.T2(U:I$3) B10.V2(T:I$2) B23.T2(U:I$3) B29.L2(E) B29.M2(F) B29.S2(E) B29.T2(F)

### Notes on the sheet
- Data Multiplexer
- D-BS-DM01-0-11 | C

## Sheet 5 of 6
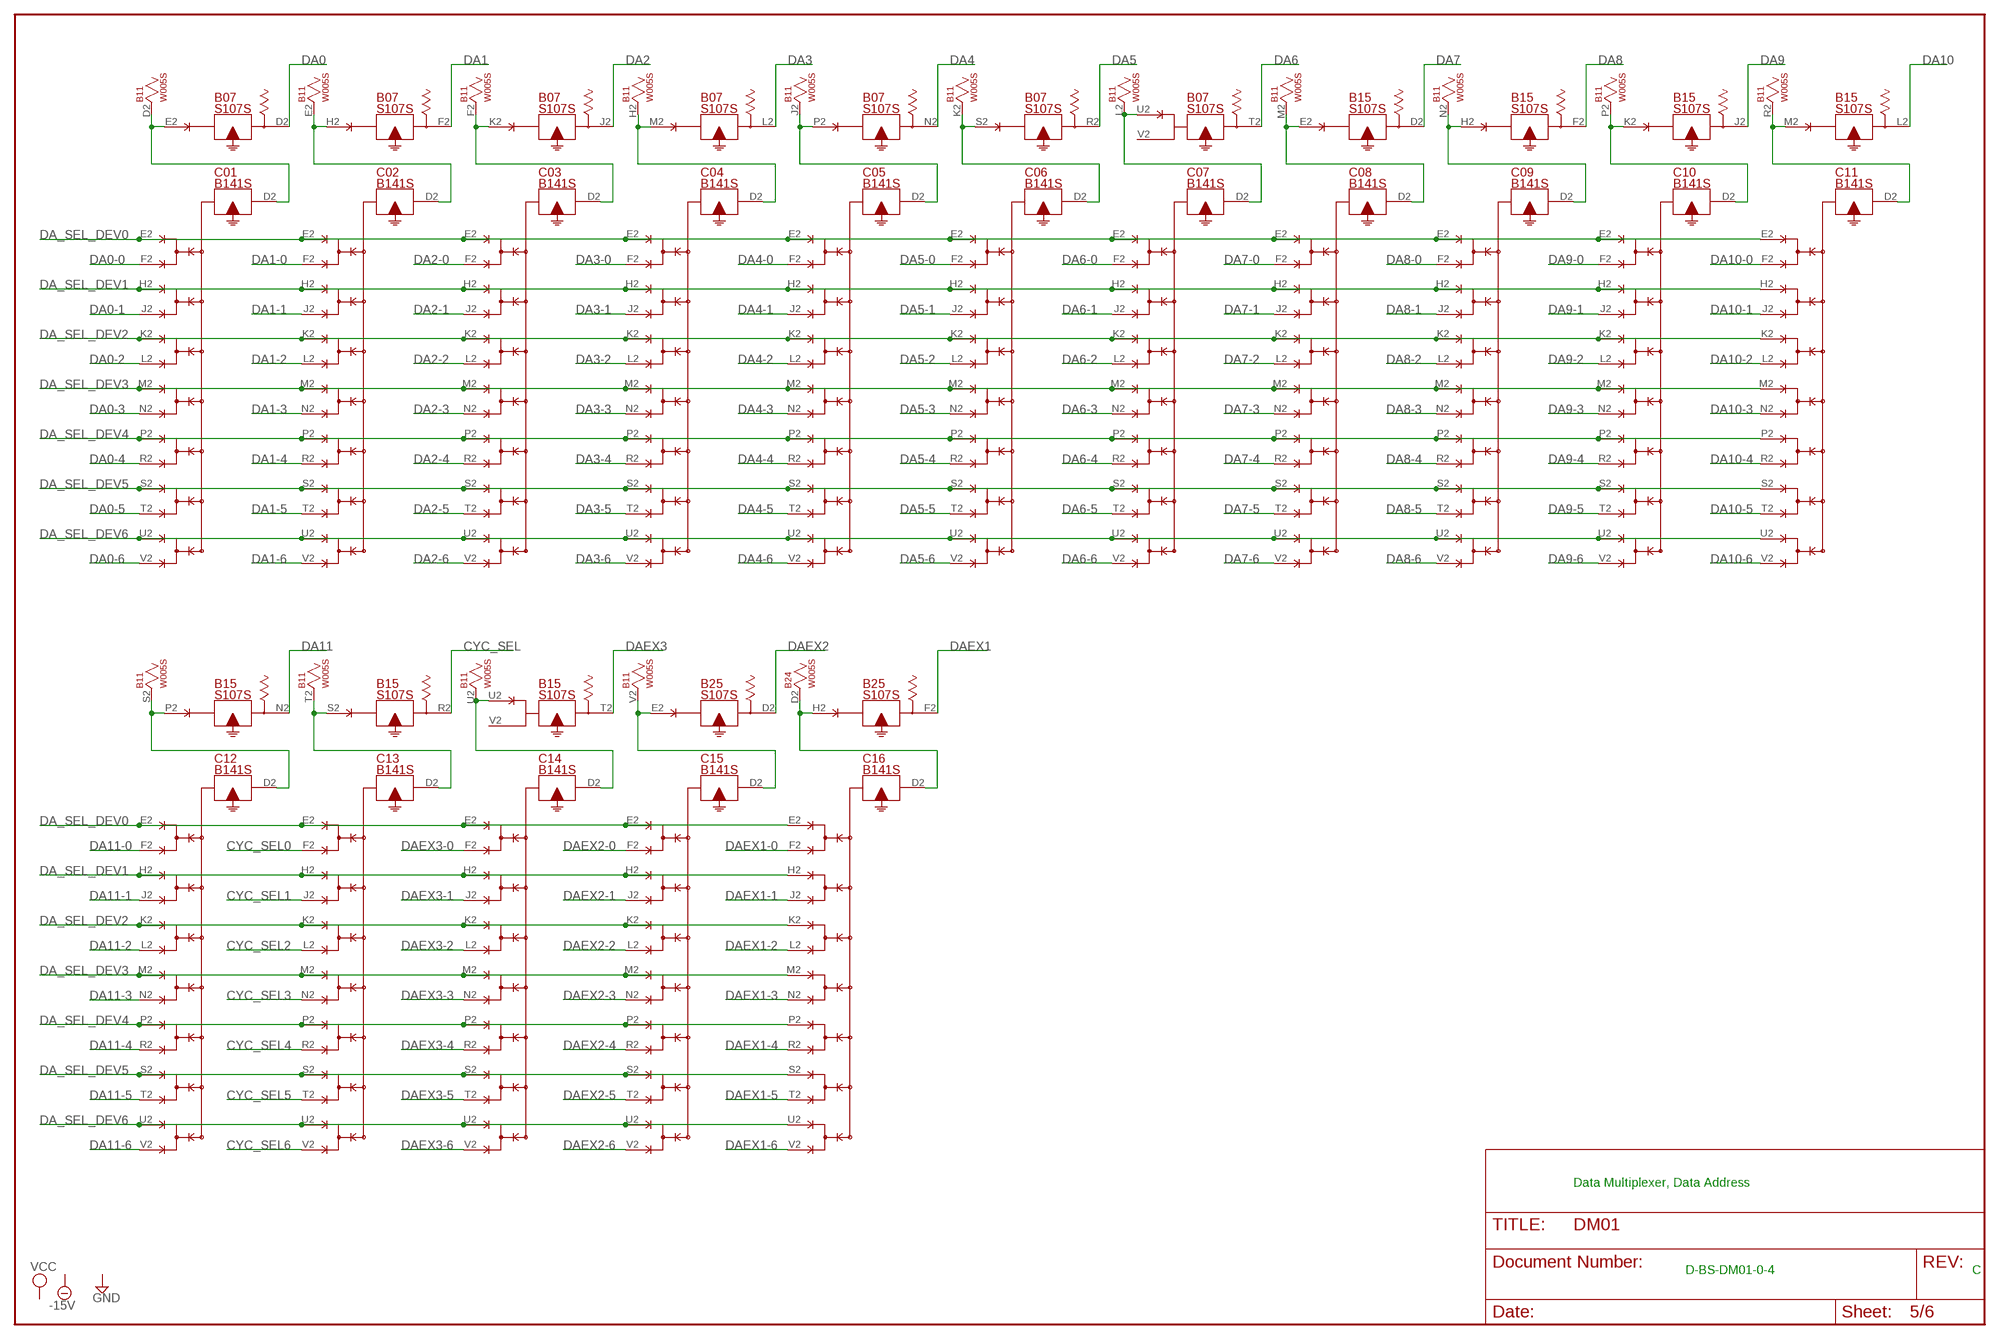
[diagram p4: schematic, sheet 5]

### Parts
B07  S107S  R107S  [H807S]
B11  W005S  [H807S]
B15  S107S  R107S  [H807S]
B24  W005S  [H807S]
B25  S107S  R107S  [H807S]
C01  B141S  R141S  [H807S]
C02  B141S  R141S  [H807S]
C03  B141S  R141S  [H807S]
C04  B141S  R141S  [H807S]
C05  B141S  R141S  [H807S]
C06  B141S  R141S  [H807S]
C07  B141S  R141S  [H807S]
C08  B141S  R141S  [H807S]
C09  B141S  R141S  [H807S]
C10  B141S  R141S  [H807S]
C11  B141S  R141S  [H807S]
C12  B141S  R141S  [H807S]
C13  B141S  R141S  [H807S]
C14  B141S  R141S  [H807S]
C15  B141S  R141S  [H807S]
C16  B141S  R141S  [H807S]

### Nets
CYC_SEL: B15.R2(R:O$1) ; also sheet 1,2
CYC_SEL0: C13.F2(F) ; also sheet 2
CYC_SEL1: C13.J2(J) ; also sheet 2
CYC_SEL2: C13.L2(L) ; also sheet 2
CYC_SEL3: C13.N2(N) ; also sheet 2
CYC_SEL4: C13.R2(R) ; also sheet 2
CYC_SEL5: C13.T2(T) ; also sheet 2
CYC_SEL6: C13.V2(V) ; also sheet 2
DA0: B07.D2(D:O$1) ; also sheet 2
DA0-0: C01.F2(F) ; also sheet 2
DA0-1: C01.J2(J) ; also sheet 2
DA0-2: C01.L2(L) ; also sheet 2
DA0-3: C01.N2(N) ; also sheet 2
DA0-4: C01.R2(R) ; also sheet 2
DA0-5: C01.T2(T) ; also sheet 2
DA0-6: C01.V2(V) ; also sheet 2
DA1: B07.F2(F:O$1) ; also sheet 2
DA1-0: C02.F2(F) ; also sheet 2
DA1-1: C02.J2(J) ; also sheet 2
DA1-2: C02.L2(L) ; also sheet 2
DA1-3: C02.N2(N) ; also sheet 2
DA1-4: C02.R2(R) ; also sheet 2
DA1-5: C02.T2(T) ; also sheet 2
DA1-6: C02.V2(V) ; also sheet 2
DA2: B07.J2(J:O$1) ; also sheet 2
DA2-0: C03.F2(F) ; also sheet 2
DA2-1: C03.J2(J) ; also sheet 2
DA2-2: C03.L2(L) ; also sheet 2
DA2-3: C03.N2(N) ; also sheet 2
DA2-4: C03.R2(R) ; also sheet 2
DA2-5: C03.T2(T) ; also sheet 2
DA2-6: C03.V2(V) ; also sheet 2
DA3: B07.L2(L:O$1) ; also sheet 2
DA3-0: C04.F2(F) ; also sheet 2
DA3-1: C04.J2(J) ; also sheet 2
DA3-2: C04.L2(L) ; also sheet 2
DA3-3: C04.N2(N) ; also sheet 2
DA3-4: C04.R2(R) ; also sheet 2
DA3-5: C04.T2(T) ; also sheet 2
DA3-6: C04.V2(V) ; also sheet 2
DA4: B07.N2(N:O$1) ; also sheet 2
DA4-0: C05.F2(F) ; also sheet 2
DA4-1: C05.J2(J) ; also sheet 2
DA4-2: C05.L2(L) ; also sheet 2
DA4-3: C05.N2(N) ; also sheet 2
DA4-4: C05.R2(R) ; also sheet 2
DA4-5: C05.T2(T) ; also sheet 2
DA4-6: C05.V2(V) ; also sheet 2
DA5: B07.R2(R:O$1) ; also sheet 2
DA5-0: C06.F2(F) ; also sheet 2
DA5-1: C06.J2(J) ; also sheet 2
DA5-2: C06.L2(L) ; also sheet 2
DA5-3: C06.N2(N) ; also sheet 2
DA5-4: C06.R2(R) ; also sheet 2
DA5-5: C06.T2(T) ; also sheet 2
DA5-6: C06.V2(V) ; also sheet 2
DA6: B07.T2(T:O$1) ; also sheet 2
DA6-0: C07.F2(F) ; also sheet 2
DA6-1: C07.J2(J) ; also sheet 2
DA6-2: C07.L2(L) ; also sheet 2
DA6-3: C07.N2(N) ; also sheet 2
DA6-4: C07.R2(R) ; also sheet 2
DA6-5: C07.T2(T) ; also sheet 2
DA6-6: C07.V2(V) ; also sheet 2
DA7: B15.D2(D:O$1) ; also sheet 2
DA7-0: C08.F2(F) ; also sheet 2
DA7-1: C08.J2(J) ; also sheet 2
DA7-2: C08.L2(L) ; also sheet 2
DA7-3: C08.N2(N) ; also sheet 2
DA7-4: C08.R2(R) ; also sheet 2
DA7-5: C08.T2(T) ; also sheet 2
DA7-6: C08.V2(V) ; also sheet 2
DA8: B15.F2(F:O$1) ; also sheet 2
DA8-0: C09.F2(F) ; also sheet 2
DA8-1: C09.J2(J) ; also sheet 2
DA8-2: C09.L2(L) ; also sheet 2
DA8-3: C09.N2(N) ; also sheet 2
DA8-4: C09.R2(R) ; also sheet 2
DA8-5: C09.T2(T) ; also sheet 2
DA8-6: C09.V2(V) ; also sheet 2
DA9: B15.J2(J:O$1) ; also sheet 2
DA9-0: C10.F2(F) ; also sheet 2
DA9-1: C10.J2(J) ; also sheet 2
DA9-2: C10.L2(L) ; also sheet 2
DA9-3: C10.N2(N) ; also sheet 2
DA9-4: C10.R2(R) ; also sheet 2
DA9-5: C10.T2(T) ; also sheet 2
DA9-6: C10.V2(V) ; also sheet 2
DA10: B15.L2(L:O$1) ; also sheet 2
DA10-0: C11.F2(F) ; also sheet 2
DA10-1: C11.J2(J) ; also sheet 2
DA10-2: C11.L2(L) ; also sheet 2
DA10-3: C11.N2(N) ; also sheet 2
DA10-4: C11.R2(R) ; also sheet 2
DA10-5: C11.T2(T) ; also sheet 2
DA10-6: C11.V2(V) ; also sheet 2
DA11: B15.N2(N:O$1) ; also sheet 2
DA11-0: C12.F2(F) ; also sheet 2
DA11-1: C12.J2(J) ; also sheet 2
DA11-2: C12.L2(L) ; also sheet 2
DA11-3: C12.N2(N) ; also sheet 2
DA11-4: C12.R2(R) ; also sheet 2
DA11-5: C12.T2(T) ; also sheet 2
DA11-6: C12.V2(V) ; also sheet 2
DA_SEL_DEV0: C01.E2(E) C02.E2(E) C03.E2(E) C04.E2(E) C05.E2(E) C06.E2(E) C07.E2(E) C08.E2(E) C09.E2(E) C10.E2(E) C11.E2(E) C12.E2(E) C13.E2(E) C14.E2(E) C15.E2(E) C16.E2(E) ; also sheet 4
DA_SEL_DEV1: C01.H2(H) C02.H2(H) C03.H2(H) C04.H2(H) C05.H2(H) C06.H2(H) C07.H2(H) C08.H2(H) C09.H2(H) C10.H2(H) C11.H2(H) C12.H2(H) C13.H2(H) C14.H2(H) C15.H2(H) C16.H2(H) ; also sheet 4
DA_SEL_DEV2: C01.K2(K) C02.K2(K) C03.K2(K) C04.K2(K) C05.K2(K) C06.K2(K) C07.K2(K) C08.K2(K) C09.K2(K) C10.K2(K) C11.K2(K) C12.K2(K) C13.K2(K) C14.K2(K) C15.K2(K) C16.K2(K) ; also sheet 4
DA_SEL_DEV3: C01.M2(M) C02.M2(M) C03.M2(M) C04.M2(M) C05.M2(M) C06.M2(M) C07.M2(M) C08.M2(M) C09.M2(M) C10.M2(M) C11.M2(M) C12.M2(M) C13.M2(M) C14.M2(M) C15.M2(M) C16.M2(M) ; also sheet 4
DA_SEL_DEV4: C01.P2(P) C02.P2(P) C03.P2(P) C04.P2(P) C05.P2(P) C06.P2(P) C07.P2(P) C08.P2(P) C09.P2(P) C10.P2(P) C11.P2(P) C12.P2(P) C13.P2(P) C14.P2(P) C15.P2(P) C16.P2(P) ; also sheet 4
DA_SEL_DEV5: C01.S2(S) C02.S2(S) C03.S2(S) C04.S2(S) C05.S2(S) C06.S2(S) C07.S2(S) C08.S2(S) C09.S2(S) C10.S2(S) C11.S2(S) C12.S2(S) C13.S2(S) C14.S2(S) C15.S2(S) C16.S2(S) ; also sheet 4
DA_SEL_DEV6: C01.U2(U) C02.U2(U) C03.U2(U) C04.U2(U) C05.U2(U) C06.U2(U) C07.U2(U) C08.U2(U) C09.U2(U) C10.U2(U) C11.U2(U) C12.U2(U) C13.U2(U) C14.U2(U) C15.U2(U) C16.U2(U) ; also sheet 4
DAEX1: B25.F2(F:O$1) ; also sheet 2
DAEX1-0: C16.F2(F) ; also sheet 2
DAEX1-1: C16.J2(J) ; also sheet 2
DAEX1-2: C16.L2(L) ; also sheet 2
DAEX1-3: C16.N2(N) ; also sheet 2
DAEX1-4: C16.R2(R) ; also sheet 2
DAEX1-5: C16.T2(T) ; also sheet 2
DAEX1-6: C16.V2(V) ; also sheet 2
DAEX2: B25.D2(D:O$1) ; also sheet 2
DAEX2-0: C15.F2(F) ; also sheet 2
DAEX2-1: C15.J2(J) ; also sheet 2
DAEX2-2: C15.L2(L) ; also sheet 2
DAEX2-3: C15.N2(N) ; also sheet 2
DAEX2-4: C15.R2(R) ; also sheet 2
DAEX2-5: C15.T2(T) ; also sheet 2
DAEX2-6: C15.V2(V) ; also sheet 2
DAEX3: B15.T2(T:O$1) ; also sheet 2
DAEX3-0: C14.F2(F) ; also sheet 2
DAEX3-1: C14.J2(J) ; also sheet 2
DAEX3-2: C14.L2(L) ; also sheet 2
DAEX3-3: C14.N2(N) ; also sheet 2
DAEX3-4: C14.R2(R) ; also sheet 2
DAEX3-5: C14.T2(T) ; also sheet 2
DAEX3-6: C14.V2(V) ; also sheet 2
N$56: B07.E2(D:I$1) B11.D2 C01.D2(D)
N$57: B07.U2(T:I$1) B11.L2 C07.D2(D)
N$58: B07.H2(F:I$1) B11.E2 C02.D2(D)
N$59: B07.K2(J:I$1) B11.F2 C03.D2(D)
N$60: B07.M2(L:I$1) B11.H2 C04.D2(D)
N$61: B07.P2(N:I$1) B11.J2 C05.D2(D)
N$62: B07.S2(R:I$1) B11.K2 C06.D2(D)
N$63: B11.M2 B15.E2(D:I$1) C08.D2(D)
N$71: B11.N2 B15.H2(F:I$1) C09.D2(D)
N$72: B11.P2 B15.K2(J:I$1) C10.D2(D)
N$73: B11.R2 B15.M2(L:I$1) C11.D2(D)
N$74: B11.S2 B15.P2(N:I$1) C12.D2(D)
N$75: B11.T2 B15.S2(R:I$1) C13.D2(D)
N$76: B11.U2 B15.U2(T:I$1) C14.D2(D)
N$77: B11.V2 B25.E2(D:I$1) C15.D2(D)
N$78: B24.D2 B25.H2(F:I$1) C16.D2(D)
Unconnected: B07.V2(T:I$2) B15.V2(T:I$2)

### Notes on the sheet
- Data Multiplexer, Data Address
- D-BS-DM01-0-4 | C

## Sheet 6 of 6
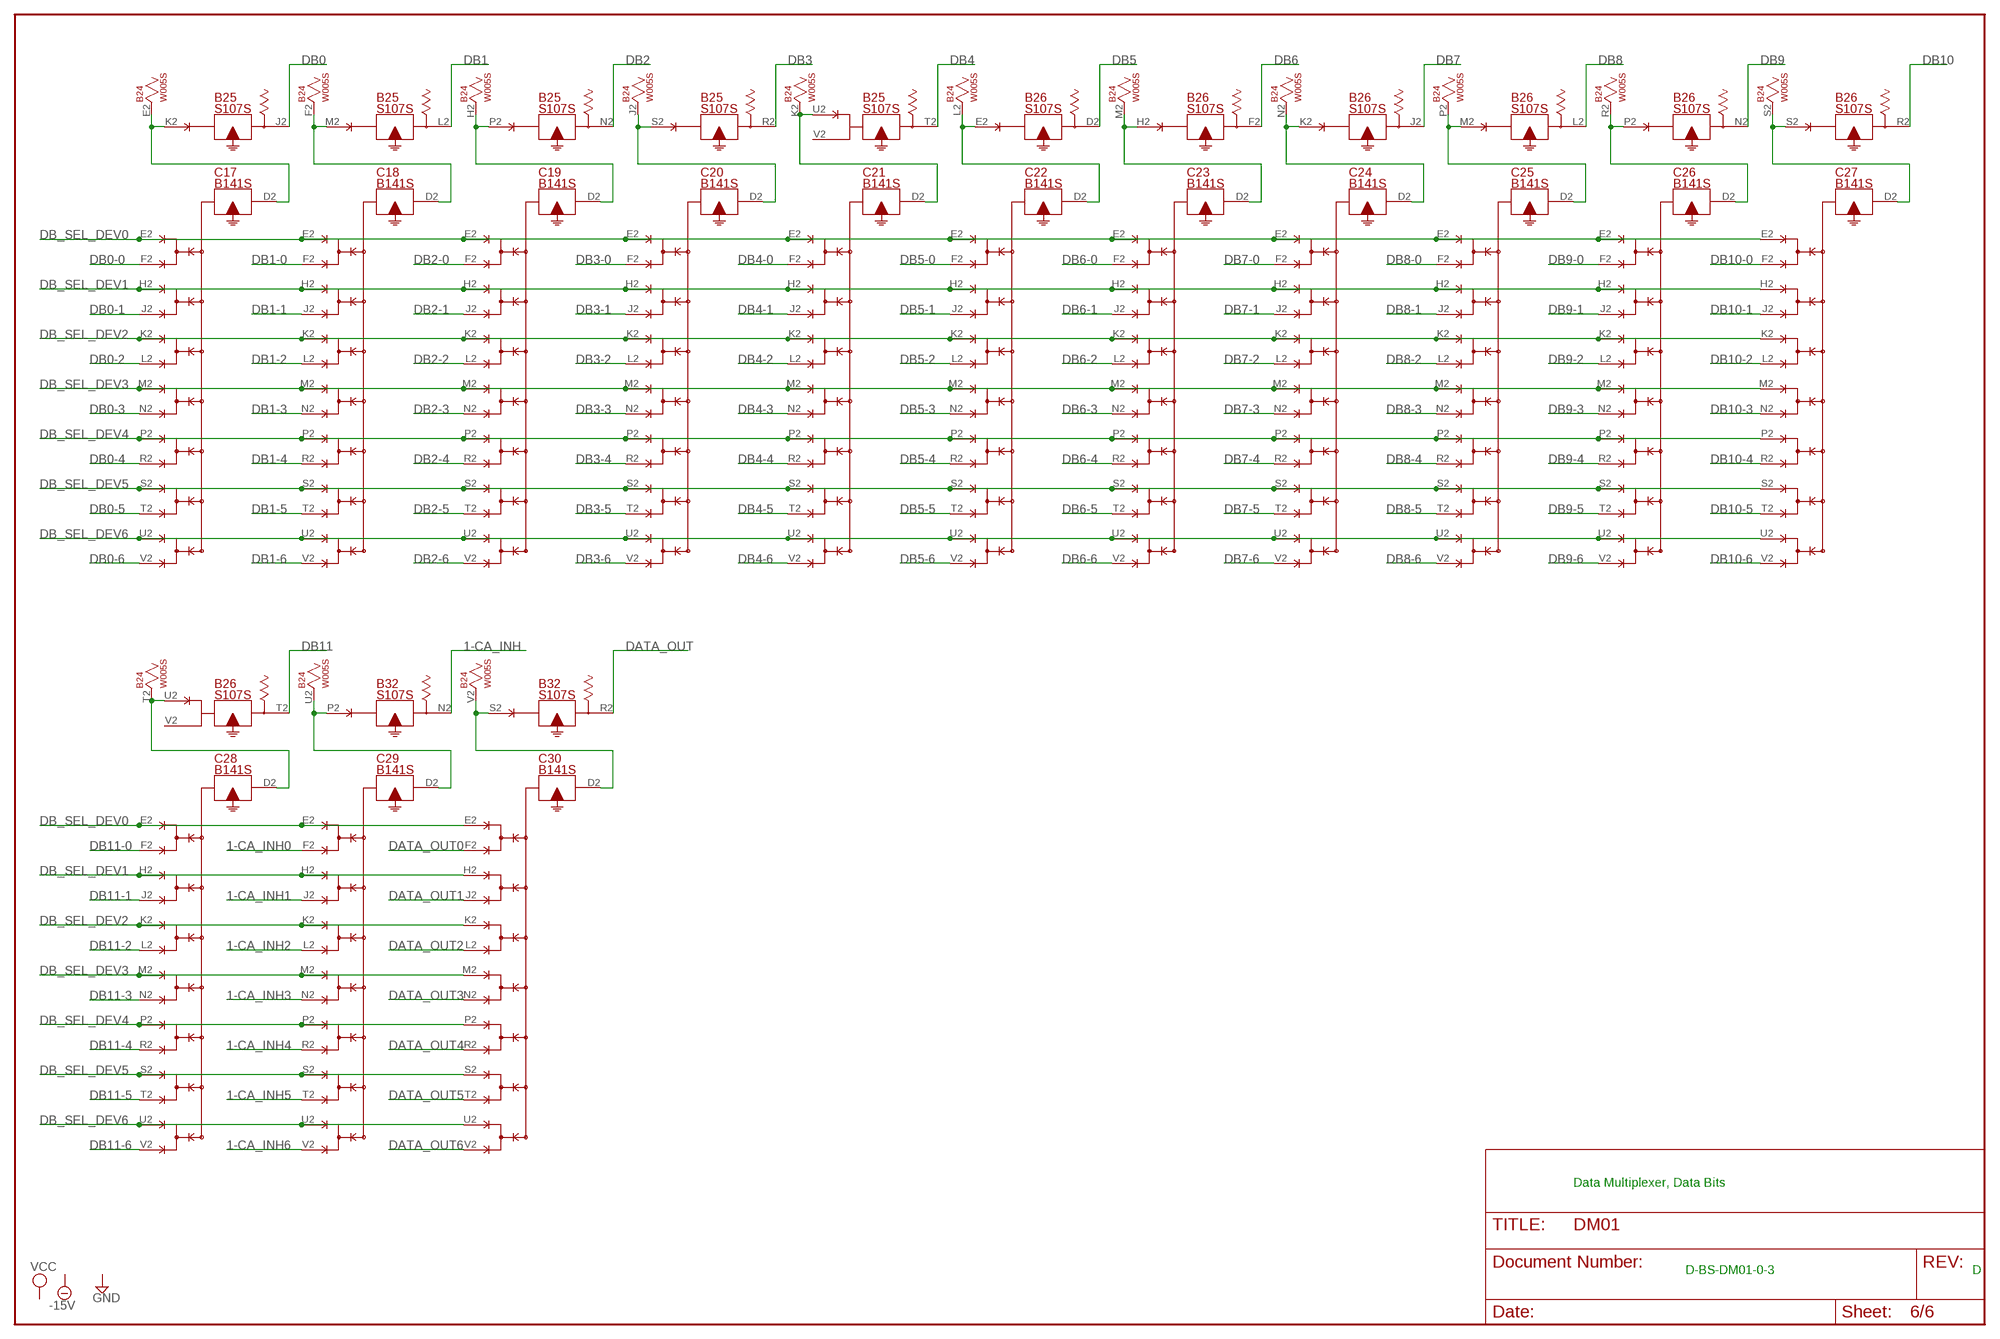
[diagram p5: schematic, sheet 6]

### Parts
B26  S107S  R107S  [H807S]
C17  B141S  R141S  [H807S]
C18  B141S  R141S  [H807S]
C19  B141S  R141S  [H807S]
C20  B141S  R141S  [H807S]
C21  B141S  R141S  [H807S]
C22  B141S  R141S  [H807S]
C23  B141S  R141S  [H807S]
C24  B141S  R141S  [H807S]
C25  B141S  R141S  [H807S]
C26  B141S  R141S  [H807S]
C27  B141S  R141S  [H807S]
C28  B141S  R141S  [H807S]
C29  B141S  R141S  [H807S]
C30  B141S  R141S  [H807S]

### Nets
1-CA_INH: B32.N2(N:O$1) ; also sheet 2
1-CA_INH0: C29.F2(F) ; also sheet 2
1-CA_INH1: C29.J2(J) ; also sheet 2
1-CA_INH2: C29.L2(L) ; also sheet 2
1-CA_INH3: C29.N2(N) ; also sheet 2
1-CA_INH4: C29.R2(R) ; also sheet 2
1-CA_INH5: C29.T2(T) ; also sheet 2
1-CA_INH6: C29.V2(V) ; also sheet 2
DATA_OUT: B32.R2(R:O$1) ; also sheet 2
DATA_OUT0: C30.F2(F) ; also sheet 2
DATA_OUT1: C30.J2(J) ; also sheet 2
DATA_OUT2: C30.L2(L) ; also sheet 2
DATA_OUT3: C30.N2(N) ; also sheet 2
DATA_OUT4: C30.R2(R) ; also sheet 2
DATA_OUT5: C30.T2(T) ; also sheet 2
DATA_OUT6: C30.V2(V) ; also sheet 2
DB0: B25.J2(J:O$1) ; also sheet 2
DB0-0: C17.F2(F) ; also sheet 2
DB0-1: C17.J2(J) ; also sheet 2
DB0-2: C17.L2(L) ; also sheet 2
DB0-3: C17.N2(N) ; also sheet 2
DB0-4: C17.R2(R) ; also sheet 2
DB0-5: C17.T2(T) ; also sheet 2
DB0-6: C17.V2(V) ; also sheet 2
DB1: B25.L2(L:O$1) ; also sheet 2
DB1-0: C18.F2(F) ; also sheet 2
DB1-1: C18.J2(J) ; also sheet 2
DB1-2: C18.L2(L) ; also sheet 2
DB1-3: C18.N2(N) ; also sheet 2
DB1-4: C18.R2(R) ; also sheet 2
DB1-5: C18.T2(T) ; also sheet 2
DB1-6: C18.V2(V) ; also sheet 2
DB2: B25.N2(N:O$1) ; also sheet 2
DB2-0: C19.F2(F) ; also sheet 2
DB2-1: C19.J2(J) ; also sheet 2
DB2-2: C19.L2(L) ; also sheet 2
DB2-3: C19.N2(N) ; also sheet 2
DB2-4: C19.R2(R) ; also sheet 2
DB2-5: C19.T2(T) ; also sheet 2
DB2-6: C19.V2(V) ; also sheet 2
DB3: B25.R2(R:O$1) ; also sheet 2
DB3-0: C20.F2(F) ; also sheet 2
DB3-1: C20.J2(J) ; also sheet 2
DB3-2: C20.L2(L) ; also sheet 2
DB3-3: C20.N2(N) ; also sheet 2
DB3-4: C20.R2(R) ; also sheet 2
DB3-5: C20.T2(T) ; also sheet 2
DB3-6: C20.V2(V) ; also sheet 2
DB4: B25.T2(T:O$1) ; also sheet 2
DB4-0: C21.F2(F) ; also sheet 2
DB4-1: C21.J2(J) ; also sheet 2
DB4-2: C21.L2(L) ; also sheet 2
DB4-3: C21.N2(N) ; also sheet 2
DB4-4: C21.R2(R) ; also sheet 2
DB4-5: C21.T2(T) ; also sheet 2
DB4-6: C21.V2(V) ; also sheet 2
DB5: B26.D2(D:O$1) ; also sheet 2
DB5-0: C22.F2(F) ; also sheet 2
DB5-1: C22.J2(J) ; also sheet 2
DB5-2: C22.L2(L) ; also sheet 2
DB5-3: C22.N2(N) ; also sheet 2
DB5-4: C22.R2(R) ; also sheet 2
DB5-5: C22.T2(T) ; also sheet 2
DB5-6: C22.V2(V) ; also sheet 2
DB6: B26.F2(F:O$1) ; also sheet 2
DB6-0: C23.F2(F) ; also sheet 2
DB6-1: C23.J2(J) ; also sheet 2
DB6-2: C23.L2(L) ; also sheet 2
DB6-3: C23.N2(N) ; also sheet 2
DB6-4: C23.R2(R) ; also sheet 2
DB6-5: C23.T2(T) ; also sheet 2
DB6-6: C23.V2(V) ; also sheet 2
DB7: B26.J2(J:O$1) ; also sheet 2
DB7-0: C24.F2(F) ; also sheet 2
DB7-1: C24.J2(J) ; also sheet 2
DB7-2: C24.L2(L) ; also sheet 2
DB7-3: C24.N2(N) ; also sheet 2
DB7-4: C24.R2(R) ; also sheet 2
DB7-5: C24.T2(T) ; also sheet 2
DB7-6: C24.V2(V) ; also sheet 2
DB8: B26.L2(L:O$1) ; also sheet 2
DB8-0: C25.F2(F) ; also sheet 2
DB8-1: C25.J2(J) ; also sheet 2
DB8-2: C25.L2(L) ; also sheet 2
DB8-3: C25.N2(N) ; also sheet 2
DB8-4: C25.R2(R) ; also sheet 2
DB8-5: C25.T2(T) ; also sheet 2
DB8-6: C25.V2(V) ; also sheet 2
DB9: B26.N2(N:O$1) ; also sheet 2
DB9-0: C26.F2(F) ; also sheet 2
DB9-1: C26.J2(J) ; also sheet 2
DB9-2: C26.L2(L) ; also sheet 2
DB9-3: C26.N2(N) ; also sheet 2
DB9-4: C26.R2(R) ; also sheet 2
DB9-5: C26.T2(T) ; also sheet 2
DB9-6: C26.V2(V) ; also sheet 2
DB10: B26.R2(R:O$1) ; also sheet 2
DB10-0: C27.F2(F) ; also sheet 2
DB10-1: C27.J2(J) ; also sheet 2
DB10-2: C27.L2(L) ; also sheet 2
DB10-3: C27.N2(N) ; also sheet 2
DB10-4: C27.R2(R) ; also sheet 2
DB10-5: C27.T2(T) ; also sheet 2
DB10-6: C27.V2(V) ; also sheet 2
DB11: B26.T2(T:O$1) ; also sheet 2
DB11-0: C28.F2(F) ; also sheet 2
DB11-1: C28.J2(J) ; also sheet 2
DB11-2: C28.L2(L) ; also sheet 2
DB11-3: C28.N2(N) ; also sheet 2
DB11-4: C28.R2(R) ; also sheet 2
DB11-5: C28.T2(T) ; also sheet 2
DB11-6: C28.V2(V) ; also sheet 2
DB_SEL_DEV0: C17.E2(E) C18.E2(E) C19.E2(E) C20.E2(E) C21.E2(E) C22.E2(E) C23.E2(E) C24.E2(E) C25.E2(E) C26.E2(E) C27.E2(E) C28.E2(E) C29.E2(E) C30.E2(E) ; also sheet 4
DB_SEL_DEV1: C17.H2(H) C18.H2(H) C19.H2(H) C20.H2(H) C21.H2(H) C22.H2(H) C23.H2(H) C24.H2(H) C25.H2(H) C26.H2(H) C27.H2(H) C28.H2(H) C29.H2(H) C30.H2(H) ; also sheet 4
DB_SEL_DEV2: C17.K2(K) C18.K2(K) C19.K2(K) C20.K2(K) C21.K2(K) C22.K2(K) C23.K2(K) C24.K2(K) C25.K2(K) C26.K2(K) C27.K2(K) C28.K2(K) C29.K2(K) C30.K2(K) ; also sheet 4
DB_SEL_DEV3: C17.M2(M) C18.M2(M) C19.M2(M) C20.M2(M) C21.M2(M) C22.M2(M) C23.M2(M) C24.M2(M) C25.M2(M) C26.M2(M) C27.M2(M) C28.M2(M) C29.M2(M) C30.M2(M) ; also sheet 4
DB_SEL_DEV4: C17.P2(P) C18.P2(P) C19.P2(P) C20.P2(P) C21.P2(P) C22.P2(P) C23.P2(P) C24.P2(P) C25.P2(P) C26.P2(P) C27.P2(P) C28.P2(P) C29.P2(P) C30.P2(P) ; also sheet 4
DB_SEL_DEV5: C17.S2(S) C18.S2(S) C19.S2(S) C20.S2(S) C21.S2(S) C22.S2(S) C23.S2(S) C24.S2(S) C25.S2(S) C26.S2(S) C27.S2(S) C28.S2(S) C29.S2(S) C30.S2(S) ; also sheet 4
DB_SEL_DEV6: C17.U2(U) C18.U2(U) C19.U2(U) C20.U2(U) C21.U2(U) C22.U2(U) C23.U2(U) C24.U2(U) C25.U2(U) C26.U2(U) C27.U2(U) C28.U2(U) C29.U2(U) C30.U2(U) ; also sheet 4
N$79: B24.E2 B25.K2(J:I$1) C17.D2(D)
N$80: B24.F2 B25.M2(L:I$1) C18.D2(D)
N$81: B24.H2 B25.P2(N:I$1) C19.D2(D)
N$82: B24.J2 B25.S2(R:I$1) C20.D2(D)
N$83: B24.K2 B25.U2(T:I$1) C21.D2(D)
N$84: B24.L2 B26.E2(D:I$1) C22.D2(D)
N$85: B24.M2 B26.H2(F:I$1) C23.D2(D)
N$86: B24.N2 B26.K2(J:I$1) C24.D2(D)
N$87: B24.P2 B26.M2(L:I$1) C25.D2(D)
N$88: B24.R2 B26.P2(N:I$1) C26.D2(D)
N$89: B24.S2 B26.S2(R:I$1) C27.D2(D)
N$90: B24.T2 B26.U2(T:I$1) C28.D2(D)
N$91: B24.U2 B32.P2(N:I$1) C29.D2(D)
N$92: B24.V2 B32.S2(R:I$1) C30.D2(D)
Unconnected: B25.V2(T:I$2) B26.V2(T:I$2)

### Notes on the sheet
- Data Multiplexer, Data Bits
- D-BS-DM01-0-3 | D

## Power pins joined to a net without a drawn wire
-15V: A12.B2(-15V) A13.B2(-15V) A14.B2(-15V) A15.B2(-15V) A16.B2(-15V) A17.B2(-15V) A18.B2(-15V) A19.B2(-15V) A22.B2 B01.B2 B02.B2(-15V) B03.B2(-15V) B04.B2(-15V) B05.B2(-15V) B06.B2(-15V) B07.B2(-15V) B08.B2(-15V) B09.B2(-15V) B10.B2(-15V) B11.B2(-15V) B12.B2(-15V) B13.B2(-15V) B14.B2(-15V) B15.B2(-15V) B16.B2(-15V) B17.B2(-15V) B18.B2(-15V) B19.B2(-15V) B20.B2(-15V) B21.B2(-15V) B22.B2(-15V) B23.B2(-15V) B24.B2(-15V) B25.B2(-15V) B26.B2(-15V) B27.B2(-15V) B28.B2(-15V) B29.B2(-15V) B30.B2(-15V) B31.B2(-15V) B32.B2(-15V) C01.B2(-15V) C02.B2(-15V) C03.B2(-15V) C04.B2(-15V) C05.B2(-15V) C06.B2(-15V) C07.B2(-15V) C08.B2(-15V) C09.B2(-15V) C10.B2(-15V) C11.B2(-15V) C12.B2(-15V) C13.B2(-15V) C14.B2(-15V) C15.B2(-15V) C16.B2(-15V) C17.B2(-15V) C18.B2(-15V) C19.B2(-15V) C20.B2(-15V) C21.B2(-15V) C22.B2(-15V) C23.B2(-15V) C24.B2(-15V) C25.B2(-15V) C26.B2(-15V) C27.B2(-15V) C28.B2(-15V) C29.B2(-15V) C30.B2(-15V) C31.B2 C32.B2 D32.B2
GND: A01.C2 A01.F2 A01.J2 A01.L2 A01.N2 A01.R2 A01.U2 A02.C2 A02.F2 A02.J2 A02.L2 A02.N2 A02.R2 A02.U2 A03.C2 A03.F2 A03.J2 A03.L2 A03.N2 A03.R2 A03.U2 A04.C2 A04.F2 A04.J2 A04.L2 A04.N2 A04.R2 A04.U2 A05.C2 A05.F2 A05.J2 A05.L2 A05.N2 A05.R2 A05.U2 A06.C2 A06.F2 A06.J2 A06.L2 A06.N2 A06.R2 A06.U2 A07.C2 A07.F2 A07.J2 A07.L2 A07.N2 A07.R2 A07.U2 A08.C2 A08.F2 A08.J2 A08.L2 A08.N2 A08.R2 A08.U2 A09.C2 A09.F2 A09.J2 A09.L2 A09.N2 A09.R2 A09.U2 A10.C2 A10.F2 A10.J2 A10.L2 A10.N2 A10.R2 A10.U2 A11.C2 A11.F2 A11.J2 A11.L2 A11.N2 A11.R2 A11.U2 A12.C2(GND) A13.C2(GND) A14.C2(GND) A15.C2(GND) A16.C2(GND) A17.C2(GND) A18.C2(GND) A19.C2(GND) A20.C2 A20.F2 A20.J2 A20.L2 A20.N2 A20.R2 A20.U2 A21.C2 A21.F2 A21.J2 A21.L2 A21.N2 A21.R2 A21.U2 A22.C2 A23.C2 A23.F2 A23.J2 A23.L2 A23.N2 A23.R2 A23.U2 A24.C2 A24.F2 A24.J2 A24.L2 A24.N2 A24.R2 A24.U2 A25.C2 A25.F2 A25.J2 A25.L2 A25.N2 A25.R2 A25.U2 A26.C2 A26.F2 A26.J2 A26.L2 A26.N2 A26.R2 A26.U2 A27.C2 A27.F2 A27.J2 A27.L2 A27.N2 A27.R2 A27.U2 A28.C2 A28.F2 A28.J2 A28.L2 A28.N2 A28.R2 A28.U2 A29.C2 A29.F2 A29.J2 A29.L2 A29.N2 A29.R2 A29.U2 A30.C2 A30.F2 A30.J2 A30.L2 A30.N2 A30.R2 A30.U2 A31.C2 A31.F2 A31.J2 A31.L2 A31.N2 A31.R2 A31.U2 A32.C2 A32.F2 A32.J2 A32.L2 A32.N2 A32.R2 A32.U2 B01.C2 B02.C2(GND) B03.C2(GND) B04.C2(GND) B05.C2(GND) B06.C2(GND) B07.C2(GND) B08.C2(GND) B09.C2(GND) B10.C2(GND) B11.C2(GND) B12.C2(GND) B13.C2(GND) B14.C2(GND) B15.C2(GND) B16.C2(GND) B17.C2(GND) B18.C2(GND) B19.C2(GND) B20.C2(GND) B21.C2(GND) B22.C2(GND) B23.C2(GND) B24.C2(GND) B25.C2(GND) B26.C2(GND) B27.C2(GND) B28.C2(GND) B29.C2(GND) B30.C2(GND) B31.C2(GND) B32.C2(GND) C01.C2(GND) C02.C2(GND) C03.C2(GND) C04.C2(GND) C05.C2(GND) C06.C2(GND) C07.C2(GND) C08.C2(GND) C09.C2(GND) C10.C2(GND) C11.C2(GND) C12.C2(GND) C13.C2(GND) C14.C2(GND) C15.C2(GND) C16.C2(GND) C17.C2(GND) C18.C2(GND) C19.C2(GND) C20.C2(GND) C21.C2(GND) C22.C2(GND) C23.C2(GND) C24.C2(GND) C25.C2(GND) C26.C2(GND) C27.C2(GND) C28.C2(GND) C29.C2(GND) C30.C2(GND) C31.C2 C32.C2 D01.C2 D01.F2 D01.J2 D01.L2 D01.N2 D01.R2 D01.U2 D02.C2 D02.F2 D02.J2 D02.L2 D02.N2 D02.R2 D02.U2 D03.C2 D03.F2 D03.J2 D03.L2 D03.N2 D03.R2 D03.U2 D04.C2 D04.F2 D04.J2 D04.L2 D04.N2 D04.R2 D04.U2 D05.C2 D05.F2 D05.J2 D05.L2 D05.N2 D05.R2 D05.U2 D06.C2 D06.F2 D06.J2 D06.L2 D06.N2 D06.R2 D06.U2 D07.C2 D07.F2 D07.J2 D07.L2 D07.N2 D07.R2 D07.U2 D08.C2 D08.F2 D08.J2 D08.L2 D08.N2 D08.R2 D08.U2 D09.C2 D09.F2 D09.J2 D09.L2 D09.N2 D09.R2 D09.U2 D10.C2 D10.F2 D10.J2 D10.L2 D10.N2 D10.R2 D10.U2 D11.C2 D11.F2 D11.J2 D11.L2 D11.N2 D11.R2 D11.U2 D12.C2 D12.F2 D12.J2 D12.L2 D12.N2 D12.R2 D12.U2 D13.C2 D13.F2 D13.J2 D13.L2 D13.N2 D13.R2 D13.U2 D14.C2 D14.F2 D14.J2 D14.L2 D14.N2 D14.R2 D14.U2 D15.C2 D15.F2 D15.J2 D15.L2 D15.N2 D15.R2 D15.U2 D16.C2 D16.F2 D16.J2 D16.L2 D16.N2 D16.R2 D16.U2 D17.C2 D17.F2 D17.J2 D17.L2 D17.N2 D17.R2 D17.U2 D18.C2 D18.F2 D18.J2 D18.L2 D18.N2 D18.R2 D18.U2 D19.C2 D19.F2 D19.J2 D19.L2 D19.N2 D19.R2 D19.U2 D20.C2 D20.F2 D20.J2 D20.L2 D20.N2 D20.R2 D20.U2 D21.C2 D21.F2 D21.J2 D21.L2 D21.N2 D21.R2 D21.U2 D22.C2 D22.F2 D22.J2 D22.L2 D22.N2 D22.R2 D22.U2 D23.C2 D23.F2 D23.J2 D23.L2 D23.N2 D23.R2 D23.U2 D24.C2 D24.F2 D24.J2 D24.L2 D24.N2 D24.R2 D24.U2 D25.C2 D25.F2 D25.J2 D25.L2 D25.N2 D25.R2 D25.U2 D26.C2 D26.F2 D26.J2 D26.L2 D26.N2 D26.R2 D26.U2 D27.C2 D27.F2 D27.J2 D27.L2 D27.N2 D27.R2 D27.U2 D28.C2 D28.F2 D28.J2 D28.L2 D28.N2 D28.R2 D28.U2 D29.C2 D29.F2 D29.J2 D29.L2 D29.N2 D29.R2 D29.U2 D30.C2 D30.F2 D30.J2 D30.L2 D30.N2 D30.R2 D30.U2 D31.C2 D31.F2 D31.J2 D31.L2 D31.N2 D31.R2 D31.U2 D32.C2
VCC: A12.A2(VCC) A13.A2(VCC) A14.A2(VCC) A15.A2(VCC) A16.A2(VCC) A17.A2(VCC) A18.A2(VCC) A19.A2(VCC) A22.A2 B01.A2 B02.A2(VCC) B03.A2(VCC) B04.A2(VCC) B05.A2(VCC) B06.A2(VCC) B07.A2(VCC) B08.A2(VCC) B09.A2(VCC) B10.A2(VCC) B11.A2(VCC) B12.A2(VCC) B13.A2(VCC) B14.A2(VCC) B15.A2(VCC) B16.A2(VCC) B17.A2(VCC) B18.A2(VCC) B19.A2(VCC) B20.A2(VCC) B21.A2(VCC) B22.A2(VCC) B23.A2(VCC) B24.A2(VCC) B25.A2(VCC) B26.A2(VCC) B27.A2(VCC) B28.A2(VCC) B29.A2(VCC) B30.A2(VCC) B31.A2(VCC) B32.A2(VCC) C01.A2(VCC) C02.A2(VCC) C03.A2(VCC) C04.A2(VCC) C05.A2(VCC) C06.A2(VCC) C07.A2(VCC) C08.A2(VCC) C09.A2(VCC) C10.A2(VCC) C11.A2(VCC) C12.A2(VCC) C13.A2(VCC) C14.A2(VCC) C15.A2(VCC) C16.A2(VCC) C17.A2(VCC) C18.A2(VCC) C19.A2(VCC) C20.A2(VCC) C21.A2(VCC) C22.A2(VCC) C23.A2(VCC) C24.A2(VCC) C25.A2(VCC) C26.A2(VCC) C27.A2(VCC) C28.A2(VCC) C29.A2(VCC) C30.A2(VCC) C31.A2 C32.A2 D32.A2

## Library data of the parts
A01-A09 A10 A11 A20 A21 A23-A32 D01-D09 D10-D31 = dec-m:W021: One-sided 9 pin connector/cable with grounds (Negibus).
A12 A13 B02 B04 B05 B07 B10 B13 B15 B25 B26 B32 = dec-m:R107: 7 Inverters
A14 A15 B27-B29 = dec-m:W640: Pulse Amplifiers
A16-A18 B06 B08 B23 B30 B31 = dec-m:R111: Diode Gate
A19 B14 B16-B21 = dec-m:R202: Dual Flip-Flop
A22 B01 C31 C32 D32 = dec-m:EMPTY: Empty Slot
B03 = dec-m:R603: Triple Pulse Amplifier
B09 B11 B24 = dec-m:W005: 15 Clamped Loads
B12 = dec-m:R181: Carry Chain/Priority Encoder
B22 = dec-m:R002: 5 Diode Networks
C01-C09 C10-C30 = dec-m:R141: AND/NOR Gate
PDP-12/8I/8 = jumper:JP3Q: JUMPER

## Net classes
1 Supply: width 0.508 mm